# Altium schematic sheet DC Battery tester.SchDoc
size 594 x 420 mm; SheetNumber: 1; SheetTotal: 1
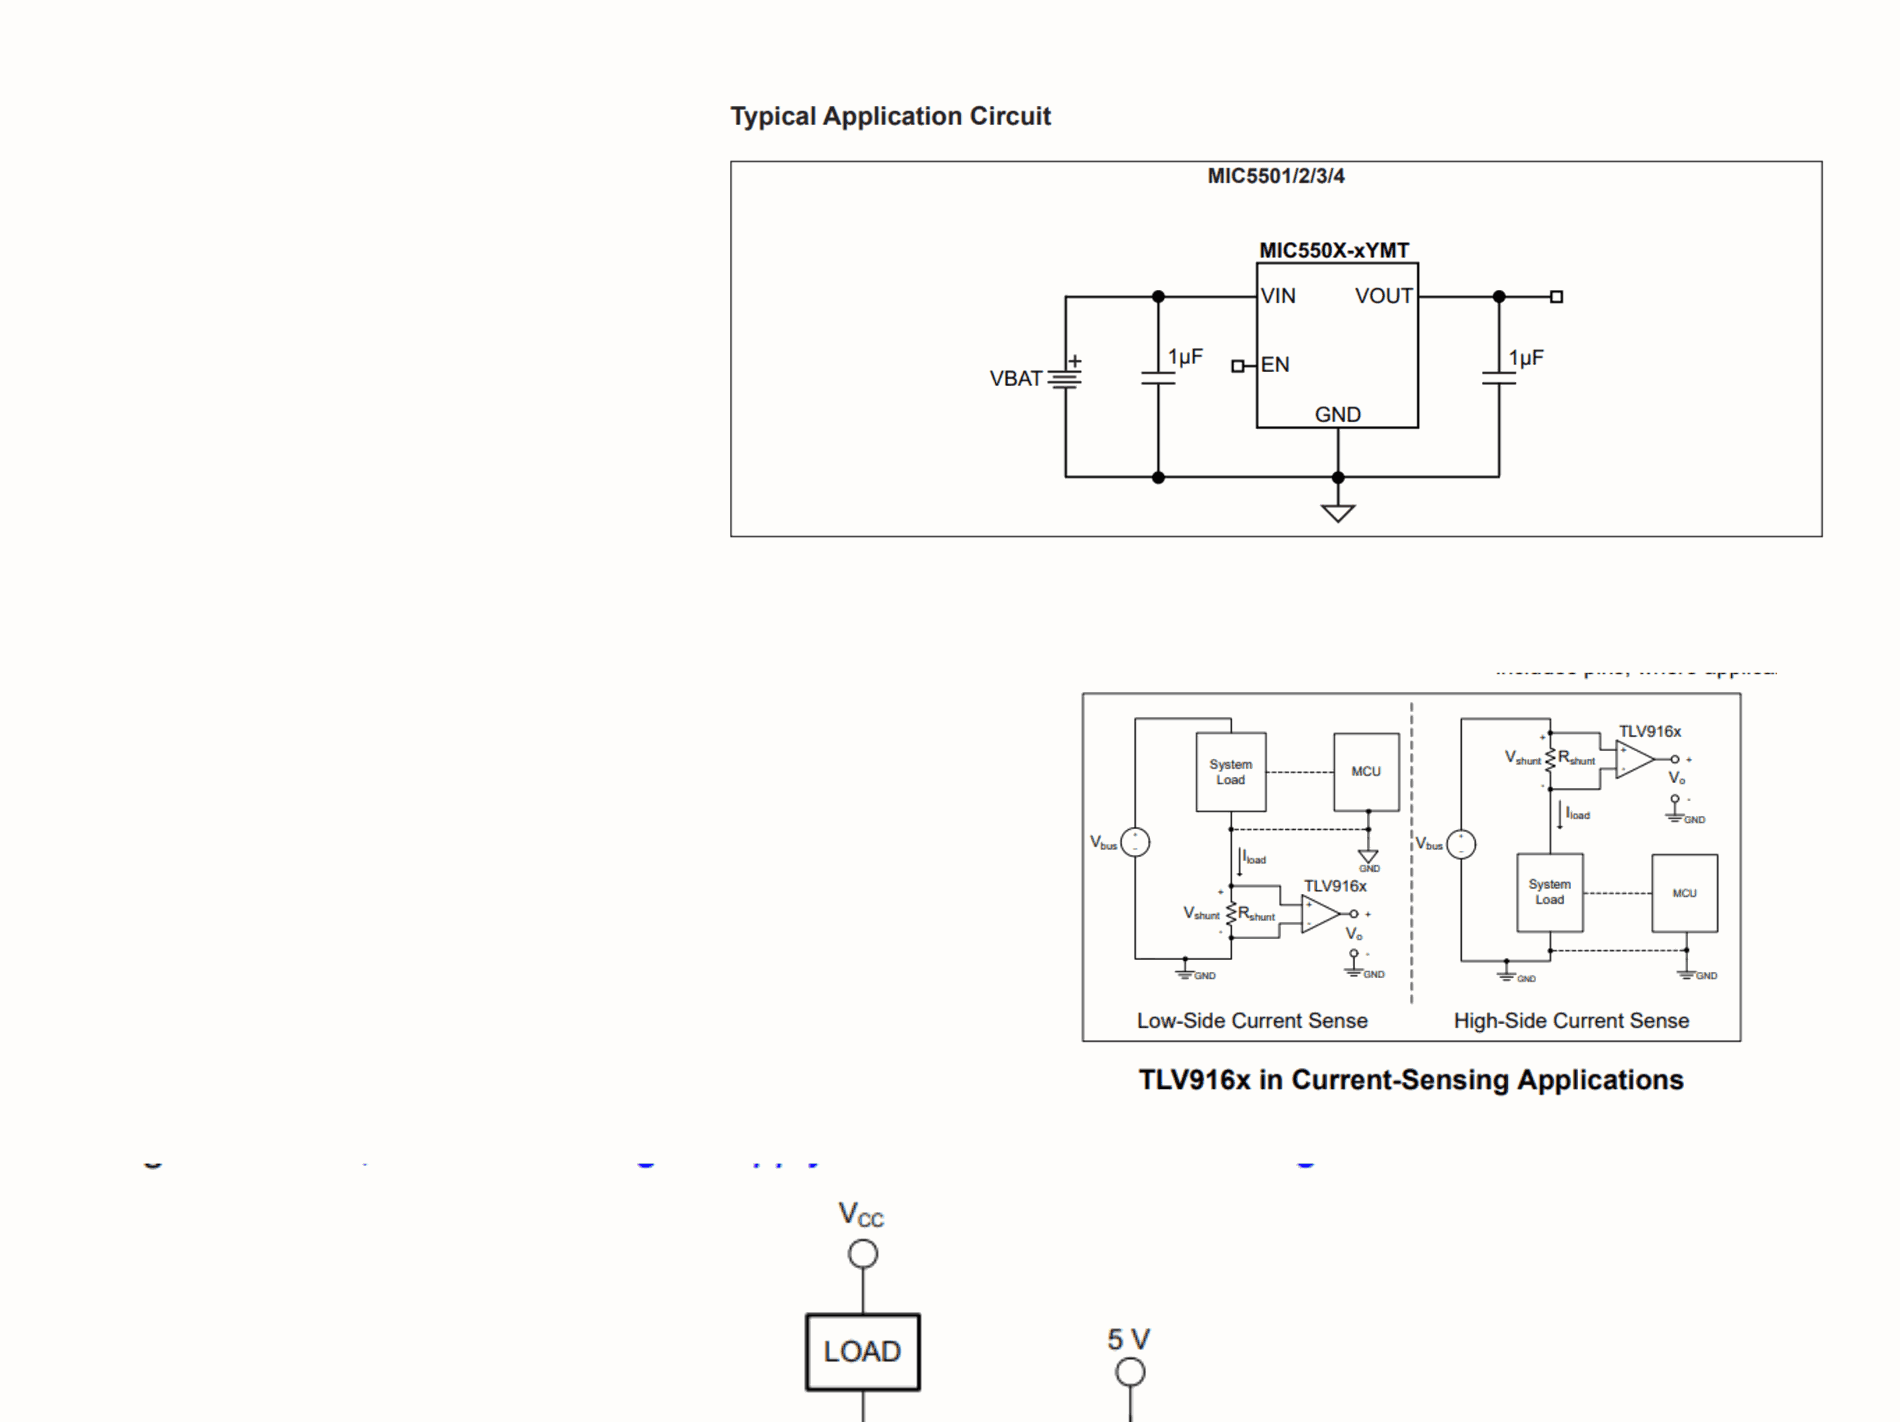
[diagram p0: DC Battery tester.SchDoc, top column 1 of 4]
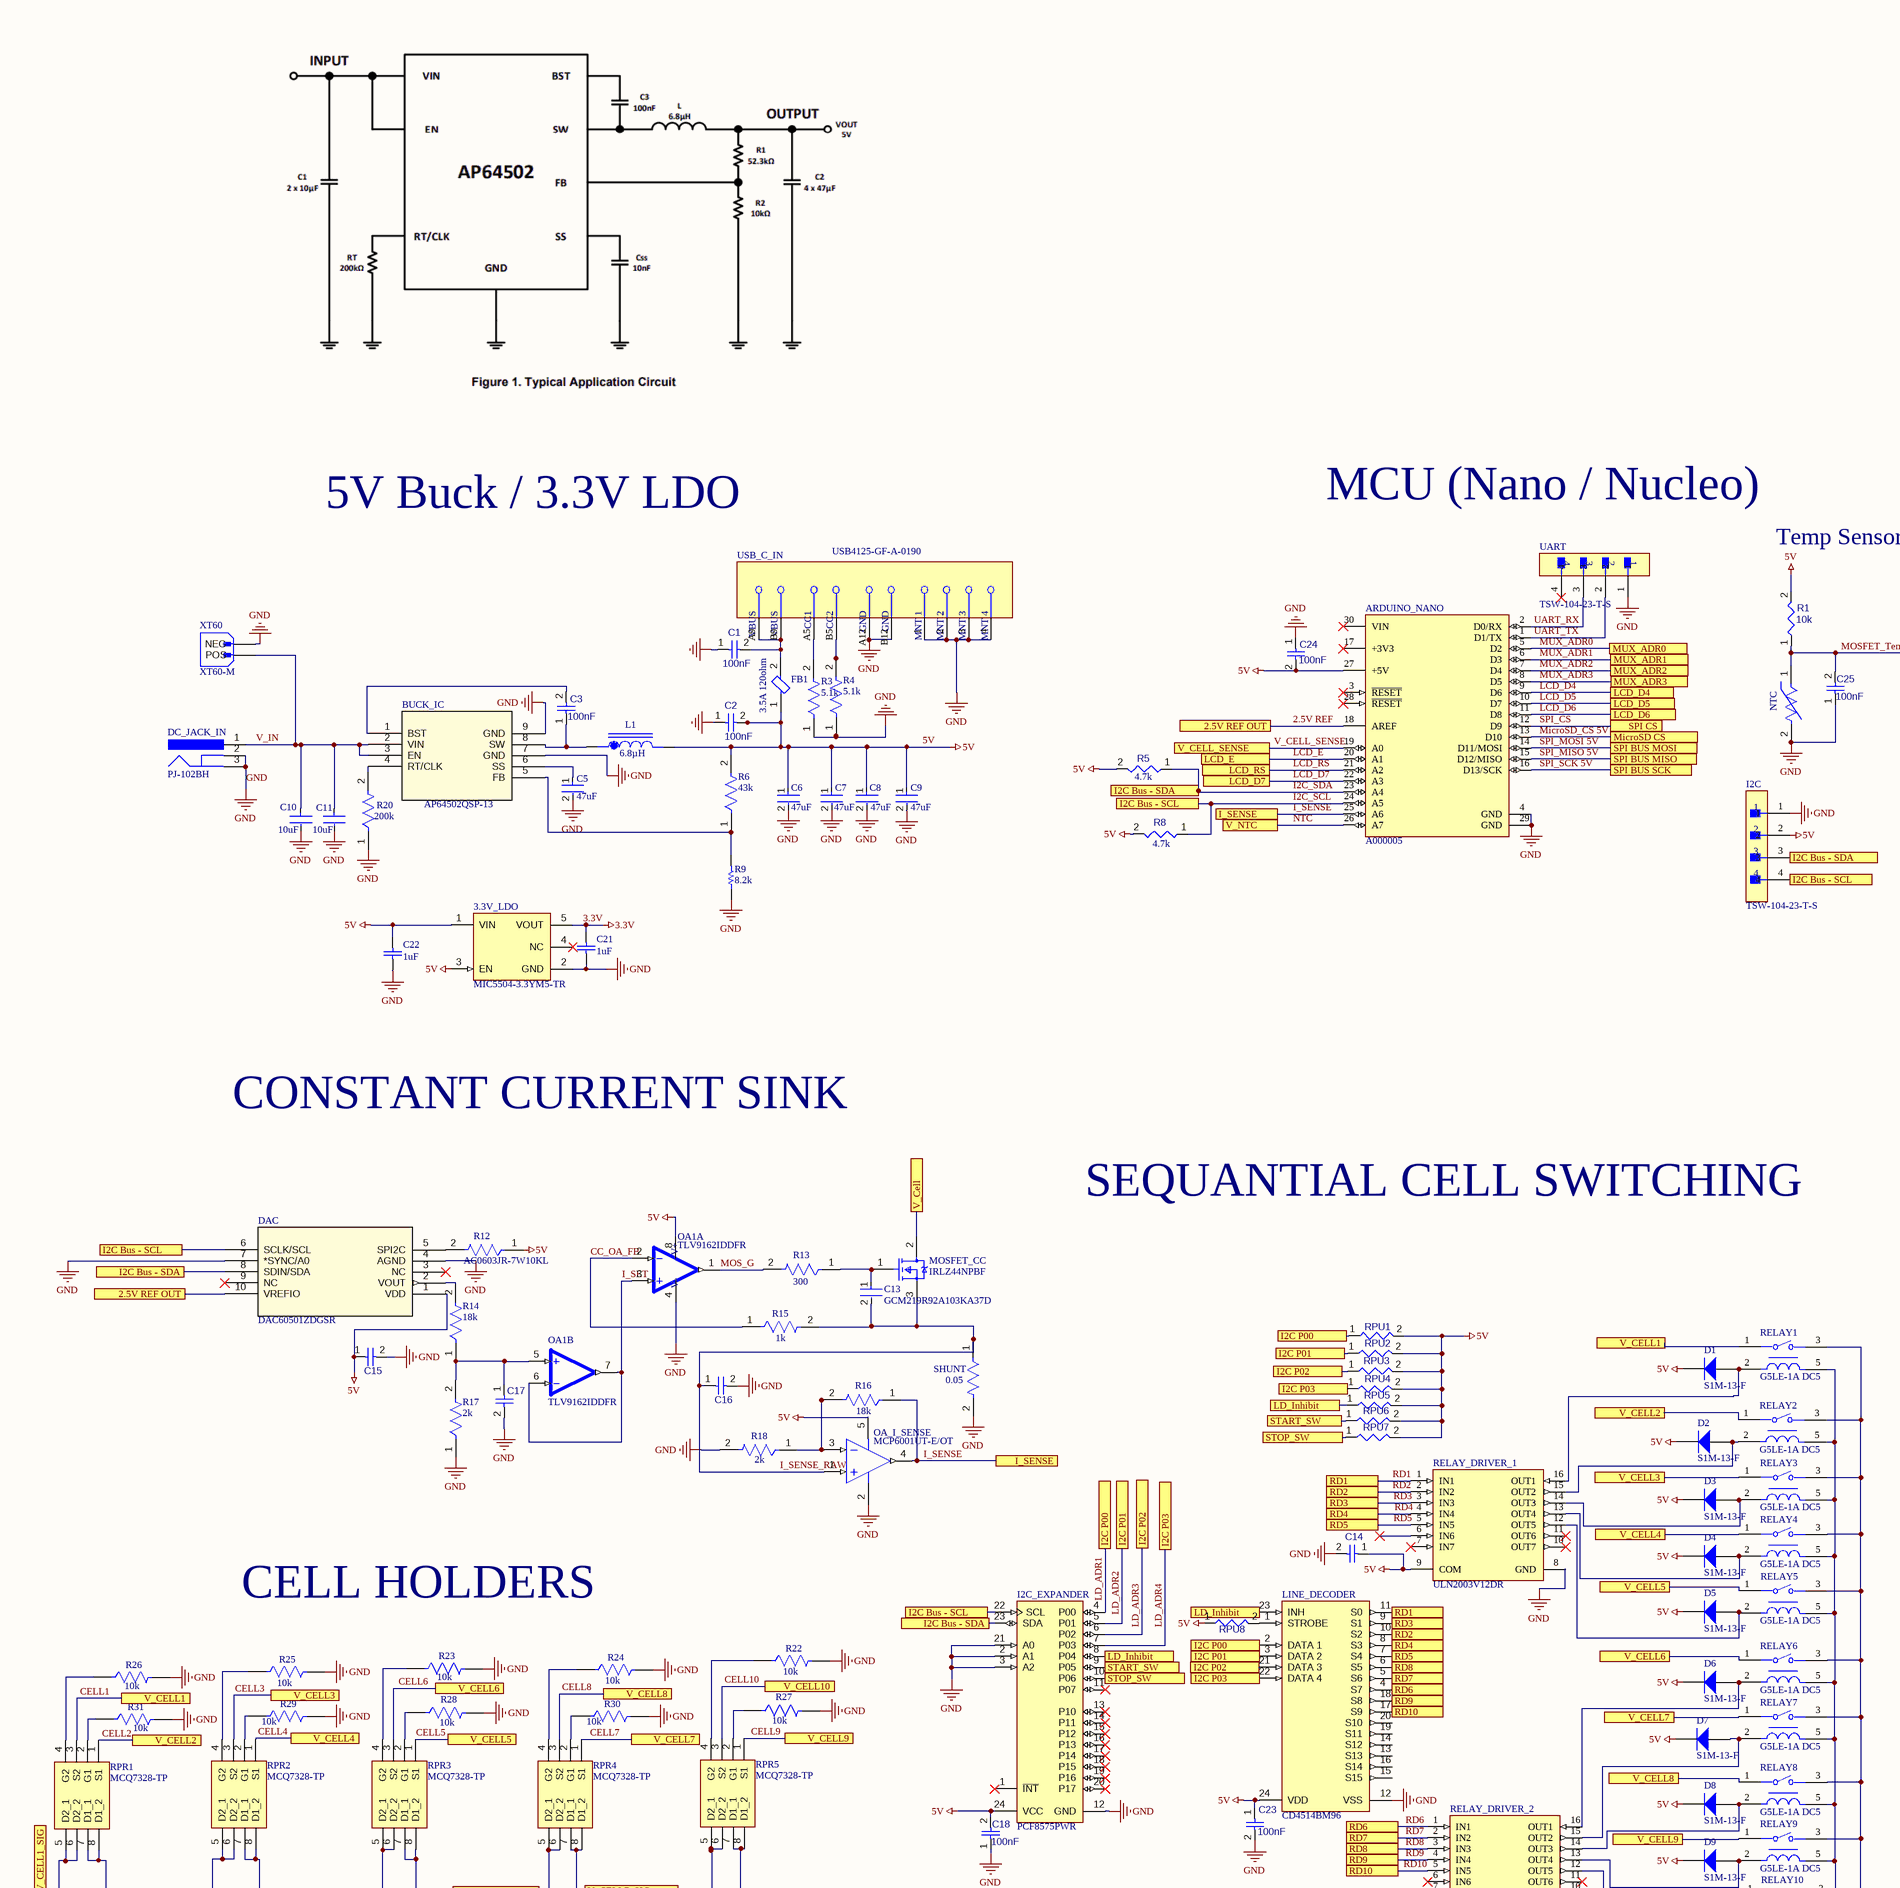
[diagram p1: DC Battery tester.SchDoc, top column 2 of 4]
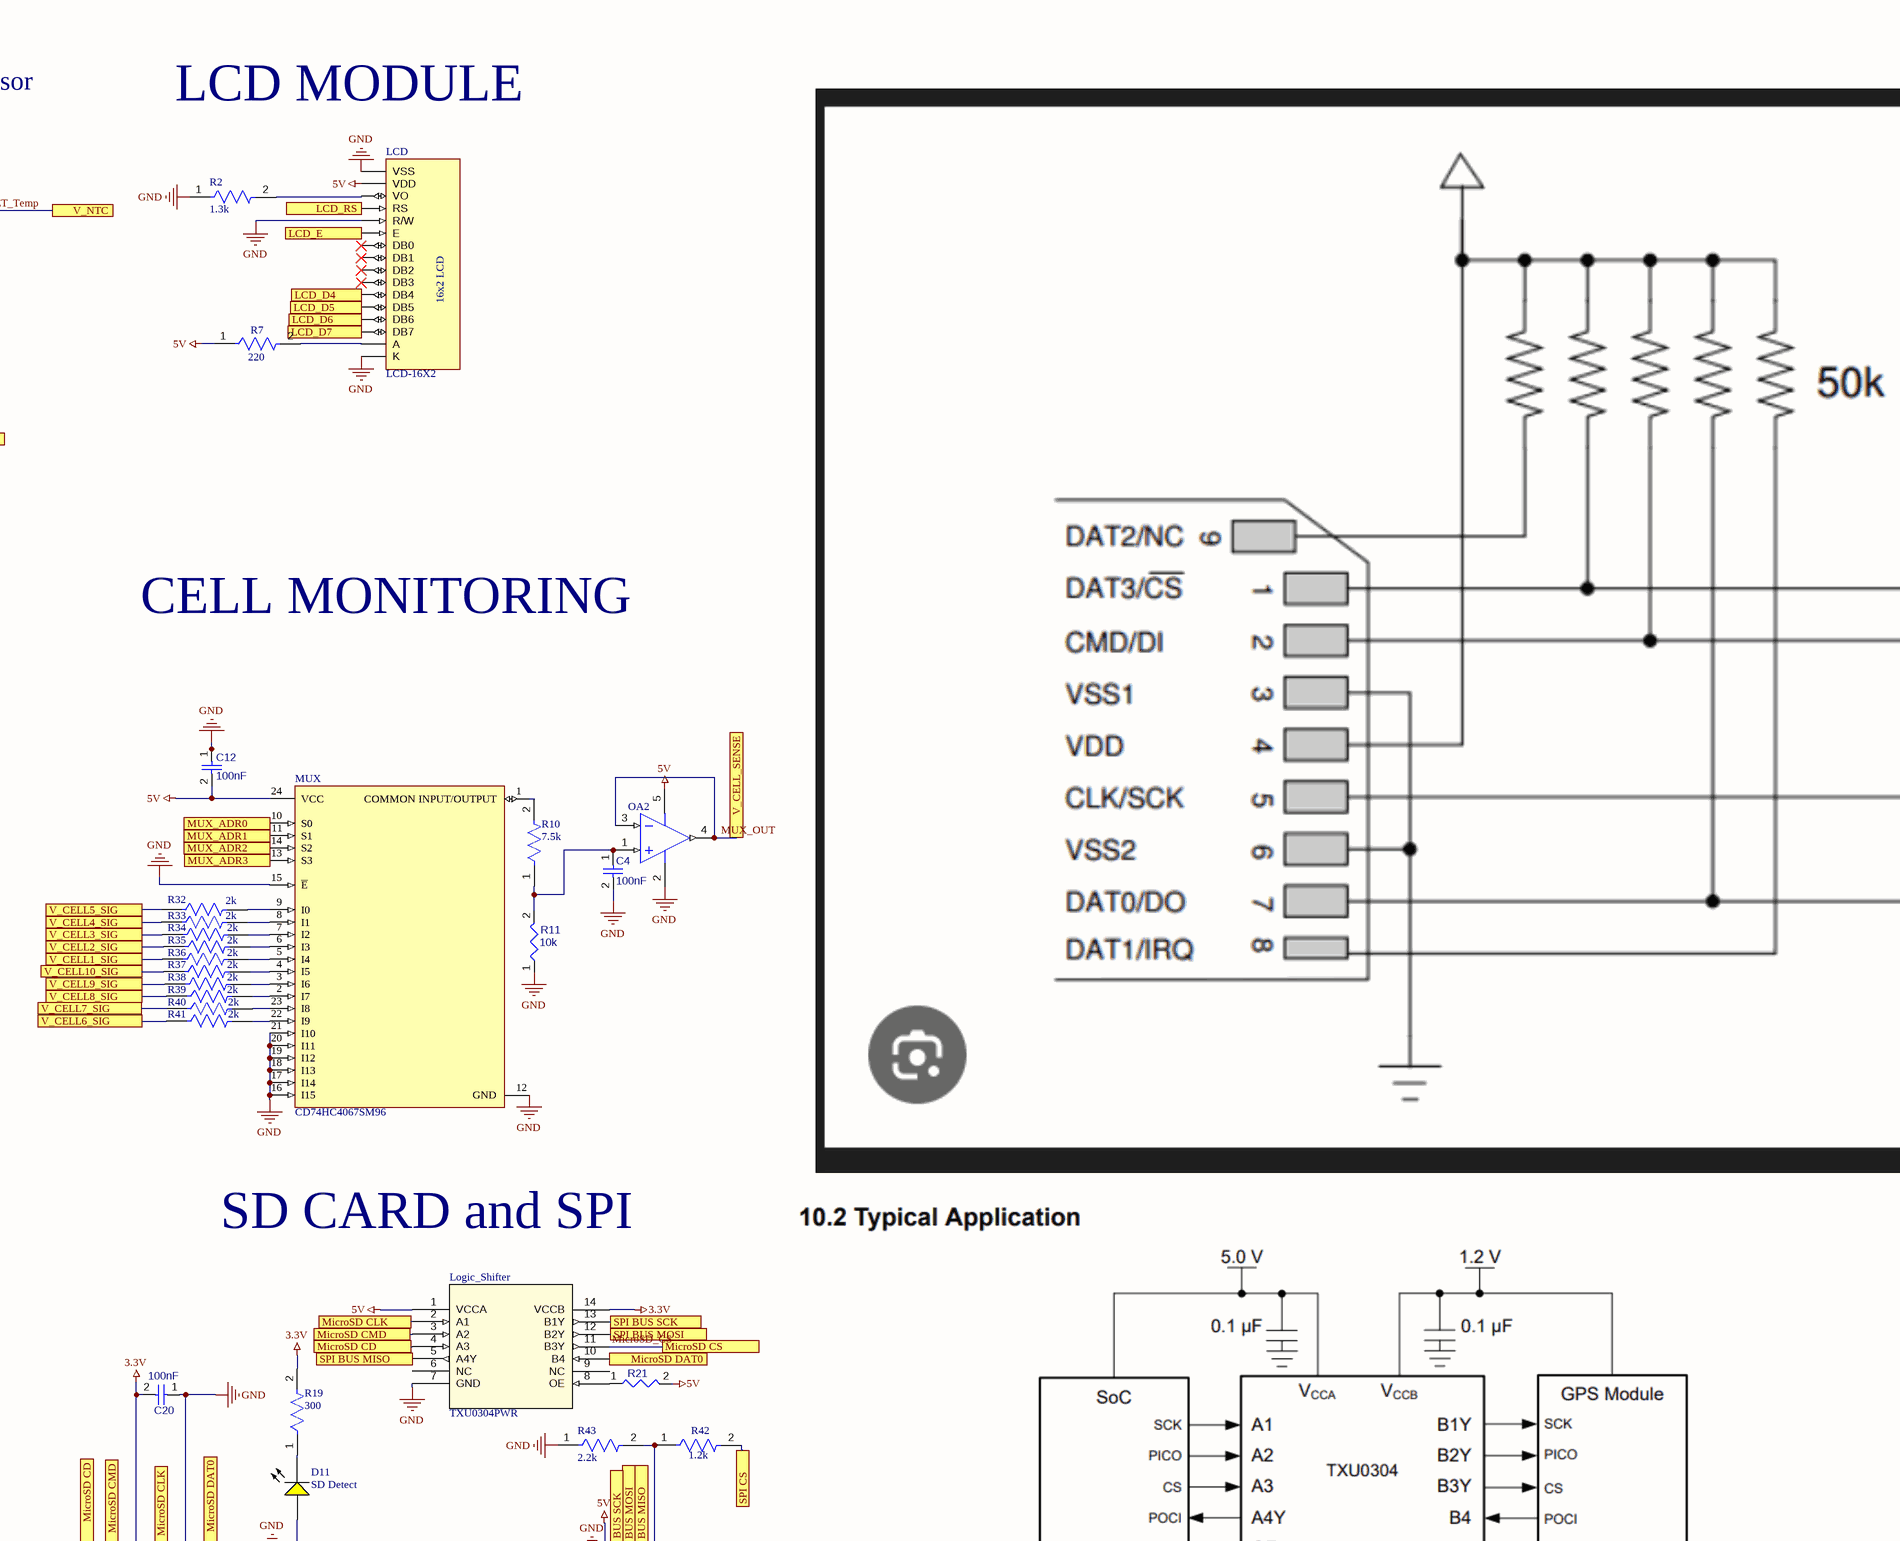
[diagram p2: DC Battery tester.SchDoc, top column 3 of 4]
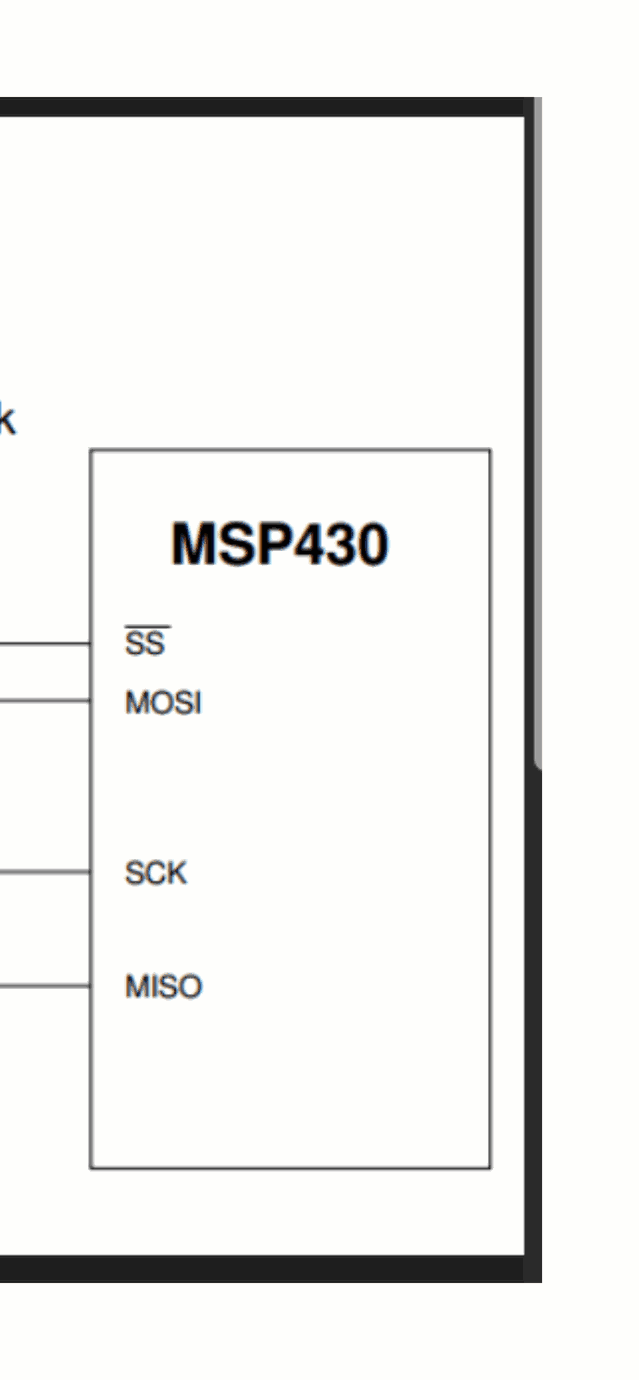
[diagram p3: DC Battery tester.SchDoc, top column 4 of 4]
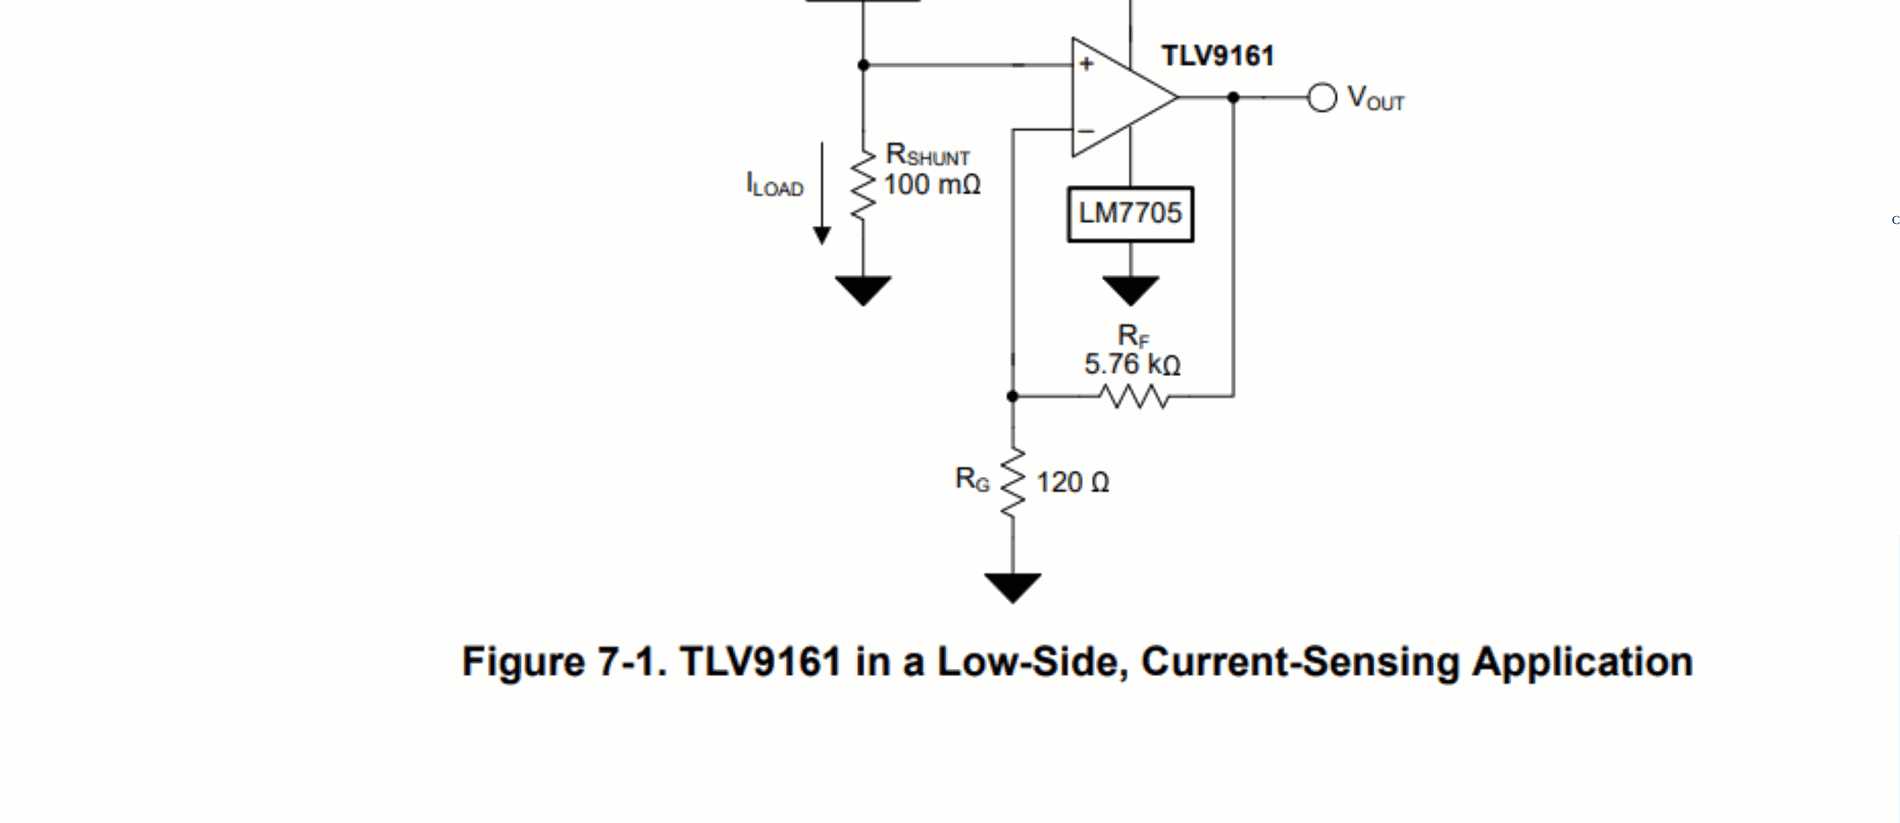
[diagram p4: DC Battery tester.SchDoc, centre column 1 of 4]
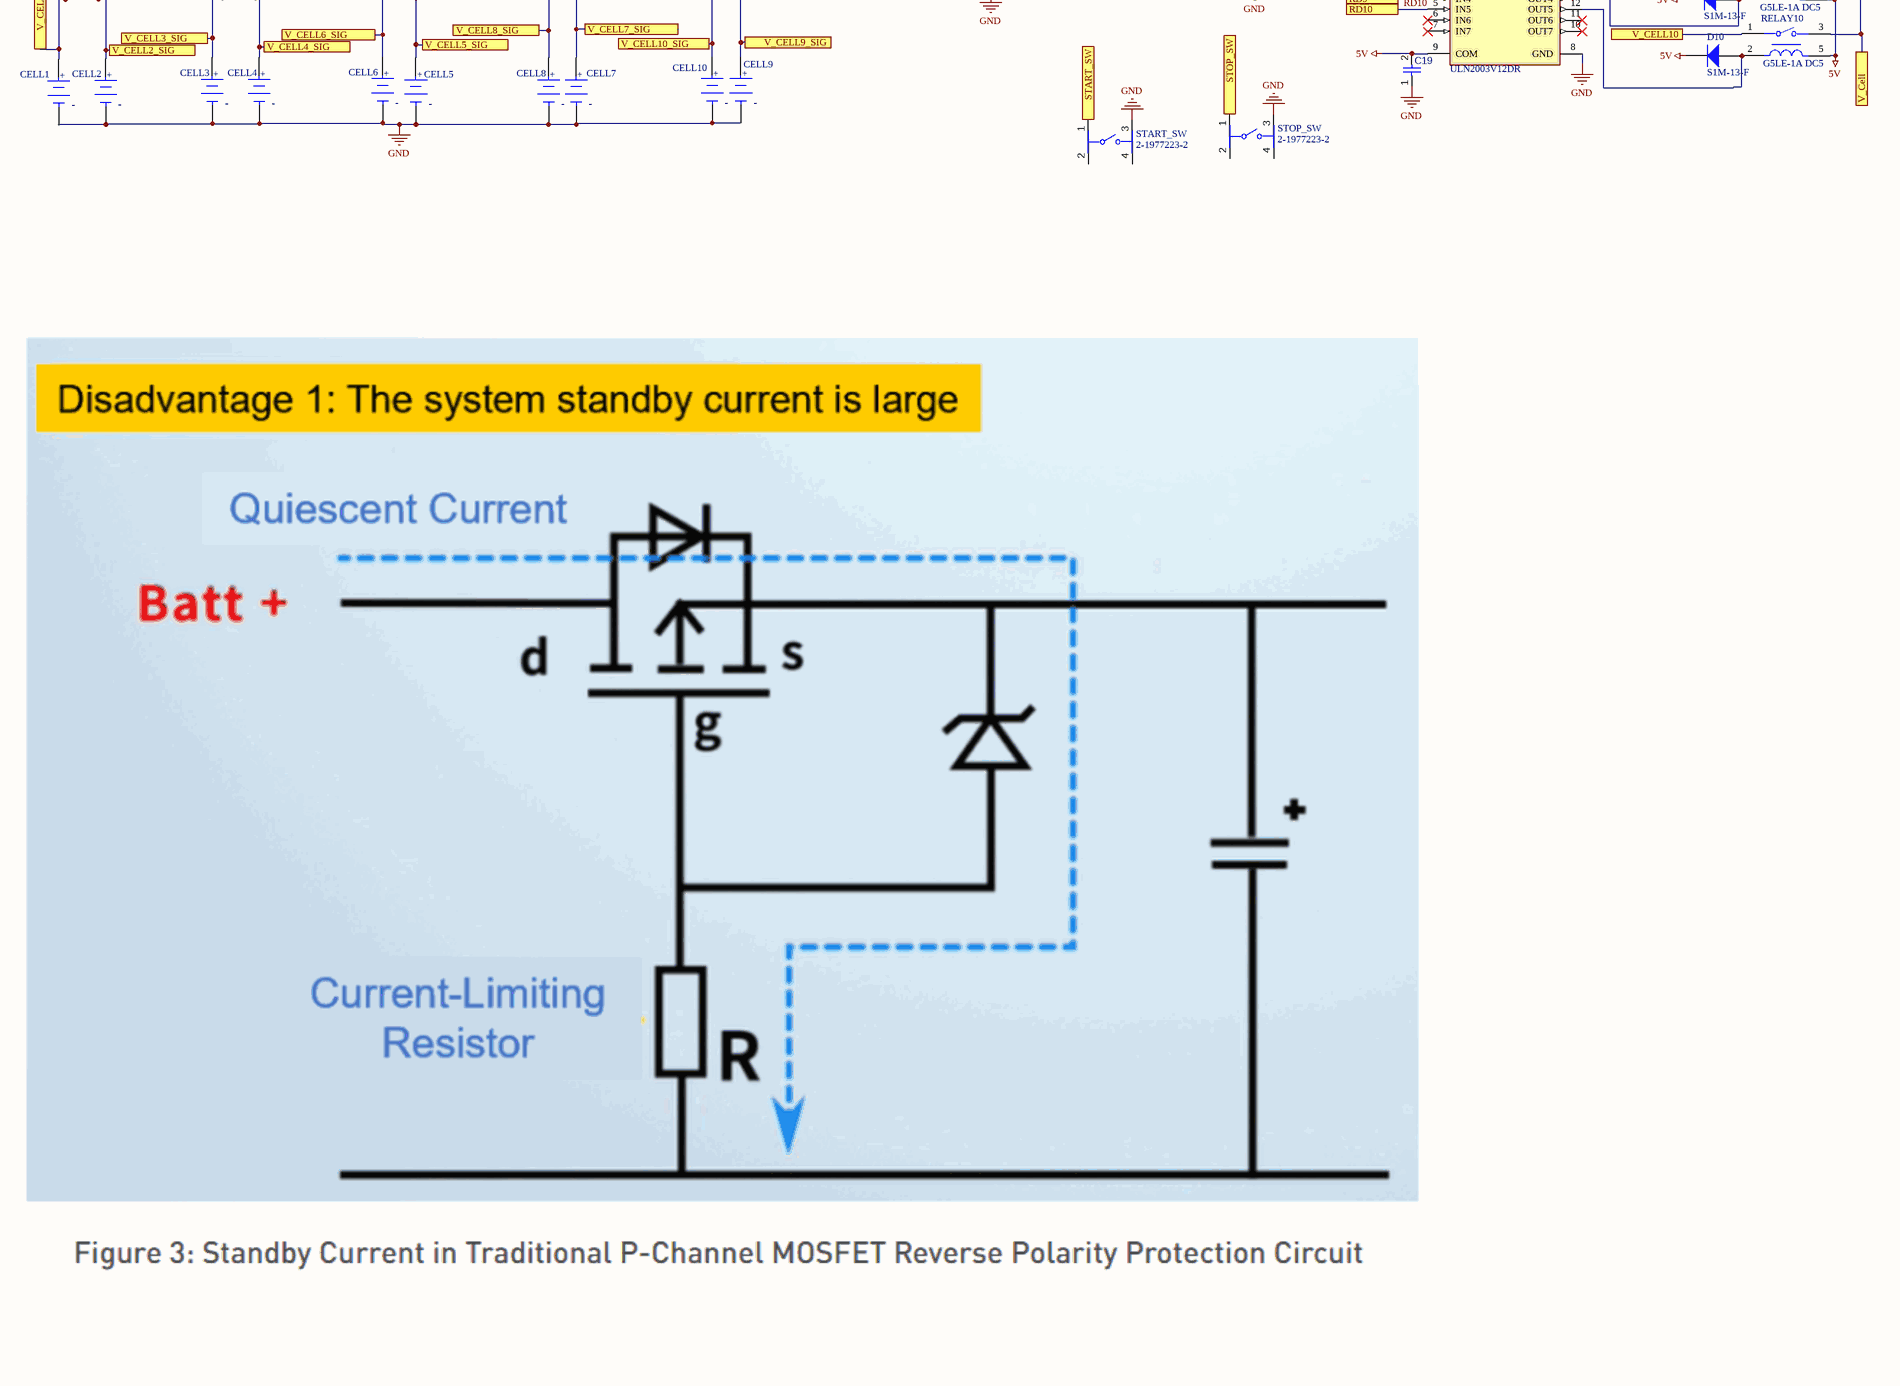
[diagram p5: DC Battery tester.SchDoc, centre column 2 of 4]
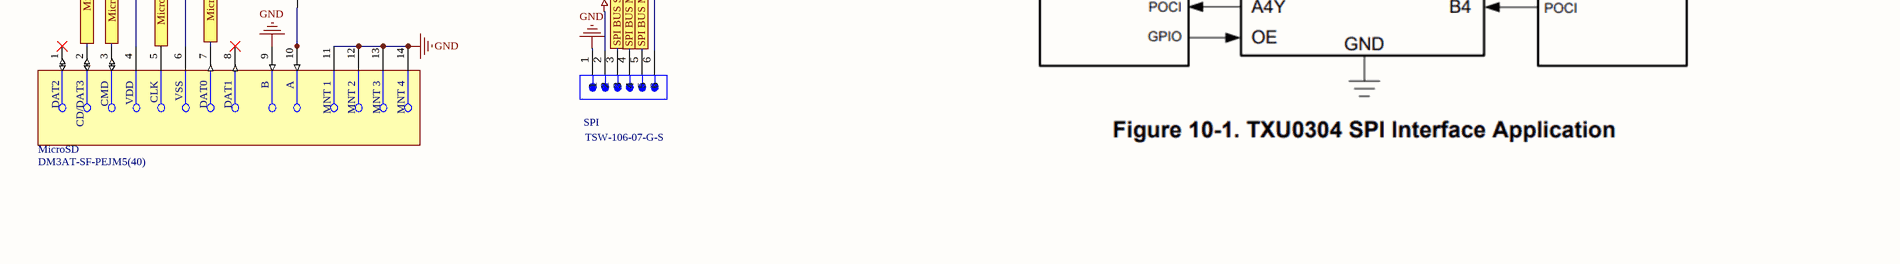
[diagram p6: DC Battery tester.SchDoc, centre column 3 of 4]

## Parts
3.3V_LDO  MIC5504-3.3YM5-TR  [FP-SOT23-5LD-PL-1-MFG]
ARDUINO_NANO  A000005  [FP-A000005-MFG]
BUCK_IC  AP64502QSP-13  [SO-8EP_DIO]
C1  100nF  [CAPC2013X95X50LL10T25]
C2  100nF  [CAPC2013X95X50LL10T25]
C3  100nF  [CAPC2013X95X50LL10T25]
C4  100nF  [CAPC2013X95X50LL10T25]
C5  47uF  [FP-GRM31C-0_2-e0_3_0_8-IPC_C]
C6  47uF  [FP-GRM31C-0_2-e0_3_0_8-IPC_C]
C7  47uF  [FP-GRM31C-0_2-e0_3_0_8-IPC_C]
C8  47uF  [FP-GRM31C-0_2-e0_3_0_8-IPC_C]
C9  47uF  [FP-GRM31C-0_2-e0_3_0_8-IPC_C]
C10  10uF  [FP-CL31-IPC_C]
C11  10uF  [FP-CL31-IPC_C]
C12  100nF  [CAPC2013X95X50LL10T25]
C13  GCM219R92A103KA37D  [FP-GCM219-0_15-IPC_C]
C14  100nF  [CAPC2013X95X50LL10T25]  (value not drawn)
C15  100nF  [CAPC2013X95X50LL10T25]  (value not drawn)
C16  100nF  [CAPC2013X95X50LL10T25]  (value not drawn)
C17  100nF  [CAPC2013X95X50LL10T25]  (value not drawn)
C18  100nF  [CAPC2013X95X50LL10T25]
C19  100nF  [CAPC2013X95X50LL10T25]  (value not drawn)
C20  100nF  [CAPC2013X95X50LL10T25]
C21  1uF  [CAPC3216X180X50ML20T25]
C22  1uF  [CAPC3216X180X50ML20T25]
C23  100nF  [CAPC2013X95X50LL10T25]
C24  100nF  [CAPC2013X95X50LL10T25]
C25  100nF  [CAPC2013X95X50LL10T25]
CELL1  1042P  [FP-1042P-MFG]  (value not drawn)
CELL2  1042P  [FP-1042P-MFG]  (value not drawn)
CELL3  1042P  [FP-1042P-MFG]  (value not drawn)
CELL4  1042P  [FP-1042P-MFG]  (value not drawn)
CELL5  1042P  [FP-1042P-MFG]  (value not drawn)
CELL6  1042P  [FP-1042P-MFG]  (value not drawn)
CELL7  1042P  [FP-1042P-MFG]  (value not drawn)
CELL8  1042P  [FP-1042P-MFG]  (value not drawn)
CELL9  1042P  [FP-1042P-MFG]  (value not drawn)
CELL10  1042P  [FP-1042P-MFG]  (value not drawn)
D1  S1M-13-F  [DIOD-S1M-13-F-SMA-2_V]
D2  S1M-13-F  [DIOD-S1M-13-F-SMA-2_V]
D3  S1M-13-F  [DIOD-S1M-13-F-SMA-2_V]
D4  S1M-13-F  [DIOD-S1M-13-F-SMA-2_V]
D5  S1M-13-F  [DIOD-S1M-13-F-SMA-2_V]
D6  S1M-13-F  [DIOD-S1M-13-F-SMA-2_V]
D7  S1M-13-F  [DIOD-S1M-13-F-SMA-2_V]
D8  S1M-13-F  [DIOD-S1M-13-F-SMA-2_V]
D9  S1M-13-F  [DIOD-S1M-13-F-SMA-2_V]
D10  S1M-13-F  [DIOD-S1M-13-F-SMA-2_V]
D11  SD Detect  [LTST-C170KSKT_V]
DAC  DAC60501ZDGSR  [DGS10_TEX]
DC_JACK_IN  PJ-102BH  [CUI-PJ-102BH_V]
FB1  3.5A 120ohm  [FP-BLM31-0_2-t1_1-MFG]
I2C  TSW-104-23-T-S  [FP-TSW-104-23-T-S-MFG]
I2C_EXPANDER  PCF8575PWR  [PW0024A_L]
L1  value 6.8µH  [IND_MGAH06036R8M-10]  (hidden comment: MGAH06036R8M-10)
LCD  LCD-16X2  [MODULE_LCD-16X2]
LINE_DECODER  CD4514BM96  [DW0024A_N]
Logic_Shifter  TXU0304PWR  [TSSOP14_PW_TEX]
MicroSD  DM3AT-SF-PEJM5(40)  [FP-DM3AT-SF-PEJM5_40-MFG]
MOSFET_CC  IRLZ44NPBF  [FP-PG-TO220-3-MFG]
MUX  CD74HC4067SM96  [FP-DB0024A-IPC_C]
NTC  NXRT15XH103FA1B030  [FP-NXR_151B030-MFG]  (value not drawn)
OA1  TLV9162IDDFR  [SOT65P280X110-8N]  (parts A,B of 2)
OA2  MCP6001UT-E/OT  [SOT-23-OT5_L]  (value not drawn)
OA_I_SENSE  MCP6001UT-E/OT  [SOT-23-OT5_L]
R1  10k  [RESC2013X50X35ML15T15]
R2  1.3k  [FP-RMCF0805-IPC_B]
R3  5.1k  [FP-MCT0603-IPC_B]
R4  5.1k  [FP-MCT0603-IPC_B]
R5  value 4.7k  [RESC2013X70X40ML20T20]  (hidden comment: Resistor 4k7 +/-1% 0805 125 mW)
R6  43k  [FP-MCU0805-IPC_C]
R7  220  [FP-RMCF0805-IPC_A]
R8  value 4.7k  [RESC2013X70X40ML20T20]  (hidden comment: Resistor 4k7 +/-1% 0805 125 mW)
R9  8.2k  [RESC0805(2012)_N]
R10  7.5k  [FP-CRCW0805-HPe3-IPC_B]
R11  10k  [RESC2013X50X35ML15T15]
R12  AC0603JR-7W10KL  [FP-AC0603-IPC_A]
R13  300  [FP-CR0805-MFG]
R14  18k  [FP-CRGP0805-IPC_C]
R15  1k  [FP-RN73R2A-IPC_A]
R16  18k  [FP-CRGP0805-IPC_C]
R17  2k  [FP-MCU0805-IPC_A]
R18  2k  [FP-MCU0805-IPC_A]
R19  300  [FP-CR0805-MFG]
R20  200k  [FP-CRCW0603-HPe3-MFG]
R21  Resistor 4k7 +/-1% 0805 125 mW  [RESC2013X70X40ML20T20]  (value not drawn)
R22  10k  [FP-AC0603-IPC_A]
R23  10k  [FP-AC0603-IPC_A]
R24  10k  [FP-AC0603-IPC_A]
R25  10k  [FP-AC0603-IPC_A]
R26  10k  [FP-AC0603-IPC_A]
R27  10k  [FP-AC0603-IPC_A]
R28  10k  [FP-AC0603-IPC_A]
R29  10k  [FP-AC0603-IPC_A]
R30  10k  [FP-AC0603-IPC_A]
R31  10k  [FP-AC0603-IPC_A]
R32  2k  [FP-TFCR0603-IPC_B]
R33  2k  [FP-TFCR0603-IPC_B]
R34  2k  [FP-TFCR0603-IPC_B]
R35  2k  [FP-TFCR0603-IPC_B]
R36  2k  [FP-TFCR0603-IPC_B]
R37  2k  [FP-TFCR0603-IPC_B]
R38  2k  [FP-TFCR0603-IPC_B]
R39  2k  [FP-TFCR0603-IPC_B]
R40  2k  [FP-TFCR0603-IPC_B]
R41  2k  [FP-TFCR0603-IPC_B]
R42  1.2k  [FP-CRGCQ0603-IPC_C]
R43  2.2k  [FP-CRGCQ0603-IPC_C]
RELAY1  G5LE-1A DC5  [FP-G5LE-1A_DC5-MFG]
RELAY2  G5LE-1A DC5  [FP-G5LE-1A_DC5-MFG]
RELAY3  G5LE-1A DC5  [FP-G5LE-1A_DC5-MFG]
RELAY4  G5LE-1A DC5  [FP-G5LE-1A_DC5-MFG]
RELAY5  G5LE-1A DC5  [FP-G5LE-1A_DC5-MFG]
RELAY6  G5LE-1A DC5  [FP-G5LE-1A_DC5-MFG]
RELAY7  G5LE-1A DC5  [FP-G5LE-1A_DC5-MFG]
RELAY8  G5LE-1A DC5  [FP-G5LE-1A_DC5-MFG]
RELAY9  G5LE-1A DC5  [FP-G5LE-1A_DC5-MFG]
RELAY10  G5LE-1A DC5  [FP-G5LE-1A_DC5-MFG]
RELAY_DRIVER_1  ULN2003V12DR  [FP-D0016A-MFG]
RELAY_DRIVER_2  ULN2003V12DR  [FP-D0016A-MFG]
RPR1  MCQ7328-TP  [SOIC127P600X175-8N]
RPR2  MCQ7328-TP  [SOIC127P600X175-8N]
RPR3  MCQ7328-TP  [SOIC127P600X175-8N]
RPR4  MCQ7328-TP  [SOIC127P600X175-8N]
RPR5  MCQ7328-TP  [SOIC127P600X175-8N]
RPU1  Resistor 4k7 +/-1% 0805 125 mW  [RESC2013X70X40ML20T20]  (value not drawn)
RPU2  Resistor 4k7 +/-1% 0805 125 mW  [RESC2013X70X40ML20T20]  (value not drawn)
RPU3  Resistor 4k7 +/-1% 0805 125 mW  [RESC2013X70X40ML20T20]  (value not drawn)
RPU4  Resistor 4k7 +/-1% 0805 125 mW  [RESC2013X70X40ML20T20]  (value not drawn)
RPU5  Resistor 4k7 +/-1% 0805 125 mW  [RESC2013X70X40ML20T20]  (value not drawn)
RPU6  Resistor 4k7 +/-1% 0805 125 mW  [RESC2013X70X40ML20T20]  (value not drawn)
RPU7  Resistor 4k7 +/-1% 0805 125 mW  [RESC2013X70X40ML20T20]  (value not drawn)
RPU8  Resistor 4k7 +/-1% 0805 125 mW  [RESC2013X70X40ML20T20]  (value not drawn)
SHUNT  0.05  [FP-CRA2512-IPC_A]
SPI  TSW-106-07-G-S  [SMTC-TSW-106-07-X-S]
START_SW  2-1977223-2  [FP-2-1977223-2-MFG]
STOP_SW  2-1977223-2  [FP-2-1977223-2-MFG]
UART  TSW-104-23-T-S  [FP-TSW-104-23-T-S-MFG]
USB_C_IN  USB4125-GF-A-0190  [FP-USB4125-GF-A-0190-MFG]
XT60  XT60-M  [AMASS_XT60-M]

## Ports
2.5V REF OUT, I2C Bus - SCL, I2C Bus - SDA, I2C P00, I2C P01, I2C P02, I2C P03, I_SENSE, LCD_D4, LCD_D5, LCD_D6, LCD_D7, LCD_E, LCD_RS, LD_Inhibit, MicroSD CD, MicroSD CLK, MicroSD CMD, MicroSD CS, MicroSD DAT0, MUX_ADR0, MUX_ADR1, MUX_ADR2, MUX_ADR3, RD1, RD2, RD3, RD4, RD5, RD6, RD7, RD8, RD9, RD10, SPI BUS MISO, SPI BUS MOSI, SPI BUS SCK, SPI CS, START_SW, STOP_SW, V_Cell, V_CELL1, V_CELL1_SIG, V_CELL2, V_CELL2_SIG, V_CELL3, V_CELL3_SIG, V_CELL4, V_CELL4_SIG, V_CELL5, V_CELL5_SIG, V_CELL6, V_CELL6_SIG, V_CELL7, V_CELL7_SIG, V_CELL8, V_CELL8_SIG, V_CELL9, V_CELL9_SIG, V_CELL10, V_CELL10_SIG, V_CELL_SENSE, V_NTC

## Nets
3.3V: 3.3V_LDO.5(VOUT) C20.2 C21.2 Logic_Shifter.14(VCCB) MicroSD.4(VDD) R19.2
5V: 3.3V_LDO.1(VIN) 3.3V_LDO.3(EN) ARDUINO_NANO.27(+5V) C2.2 C6.1 C7.1 C8.1 C9.1 C12.2 C14.1 C15.1 C18.2 C19.2 C22.2 C23.1 C24.2 D1.2(K) D2.2(K) D3.2(K) D4.2(K) D5.2(K) D6.2(K) D7.2(K) D8.2(K) D9.2(K) D10.2(K) DAC.1(VDD) FB1.1 I2C.2 I2C_EXPANDER.24(VCC) L1.2 LCD.2(VDD) LINE_DECODER.24(VDD) Logic_Shifter.1(VCCA) MUX.24(VCC) OA1.8(V+) OA2.5(VDD) OA_I_SENSE.5(VDD) R1.2 R5.2 R6.2 R7.1 R8.2 R12.1 R21.2 RELAY1.5 RELAY2.5 RELAY3.5 RELAY4.5 RELAY5.5 RELAY6.5 RELAY7.5 RELAY8.5 RELAY9.5 RELAY10.5 RELAY_DRIVER_1.9(COM) RELAY_DRIVER_2.9(COM) RPU1.2 RPU2.2 RPU3.2 RPU4.2 RPU5.2 RPU6.2 RPU7.2 RPU8.1 SPI.2
GND: 3.3V_LDO.2(GND) ARDUINO_NANO.4(GND) ARDUINO_NANO.29(GND) BUCK_IC.7(GND) BUCK_IC.9(GND) C1.1 C2.1 C4.2 C5.2 C6.2 C7.2 C8.2 C9.2 C10.2 C11.2 C12.1 C14.2 C15.2 C16.2 C17.2 C18.1 C19.1 C20.1 C21.1 C22.1 C23.2 C24.1 C25.1 CELL1.1(C) CELL2.1(C) CELL3.1(C) CELL4.1(C) CELL5.1(C) CELL6.1(C) CELL7.1(C) CELL8.1(C) CELL9.1(C) CELL10.1(C) DAC.4(AGND) DAC.7(*SYNC/A0) DC_JACK_IN.2 DC_JACK_IN.3 I2C.1 I2C_EXPANDER.2(A1) I2C_EXPANDER.3(A2) I2C_EXPANDER.12(GND) I2C_EXPANDER.21(A0) LCD.1(VSS) LCD.5(R/W) LCD.16(K) LINE_DECODER.12(VSS) Logic_Shifter.7(GND) MicroSD.6(VSS) MicroSD.9(B) MicroSD.11(MNT_1) MicroSD.12(MNT_2) MicroSD.13(MNT_3) MicroSD.14(MNT_4) MUX.12(GND) MUX.15(~{E}) MUX.16(I15) MUX.17(I14) MUX.18(I13) MUX.19(I12) MUX.20(I11) MUX.21(I10) NTC.2 OA1.4(V-) OA2.2(VSS) OA_I_SENSE.2(VSS) R2.1 R3.1 R4.1 R9.1 R11.1 R17.1 R18.2 R20.1 R22.2 R23.2 R24.2 R25.2 R26.2 R27.2 R28.2 R29.2 R30.2 R31.2 R43.1 RELAY_DRIVER_1.8(GND) RELAY_DRIVER_2.8(GND) SHUNT.2 SPI.1 START_SW.3 STOP_SW.3 UART.1 USB_C_IN.1(MNT_1) USB_C_IN.2(MNT_2) USB_C_IN.3(MNT_3) USB_C_IN.4(MNT_4) USB_C_IN.A12(GND) USB_C_IN.B12(GND) XT60.N(NEG)
2.5V REF: ARDUINO_NANO.18(AREF) DAC.10(VREFIO) ; port 2.5V REF OUT
CC_OA_FB: OA1.2(IN1-) R15.1
CELL1: RELAY1.1 RPR1.3(S2) ; port V_CELL1
CELL2: RELAY2.1 RPR1.1(S1) ; port V_CELL2
CELL3: RELAY3.1 RPR2.3(S2) ; port V_CELL3
CELL4: RELAY4.1 RPR2.1(S1) ; port V_CELL4
CELL5: RELAY5.1 RPR3.1(S1) ; port V_CELL5
CELL6: RELAY6.1 RPR3.3(S2) ; port V_CELL6
CELL7: RELAY7.1 RPR4.1(S1) ; port V_CELL7
CELL8: RELAY8.1 RPR4.3(S2) ; port V_CELL8
CELL9: RELAY9.1 RPR5.1(S1) ; port V_CELL9
CELL10: RELAY10.1 RPR5.3(S2) ; port V_CELL10
I2C_SCL: ARDUINO_NANO.24(A5) DAC.6(SCLK/SCL) I2C.4 I2C_EXPANDER.22(SCL) R8.1 ; port I2C Bus - SCL
I2C_SDA: ARDUINO_NANO.23(A4) DAC.8(SDIN/SDA) I2C.3 I2C_EXPANDER.23(SDA) R5.1 ; port I2C Bus - SDA
I_SENSE: ARDUINO_NANO.25(A6) OA_I_SENSE.4(VOUT) R16.1 ; port I_SENSE
I_SENSE_RAW: C13.2 C16.1 MOSFET_CC.3(S) OA_I_SENSE.1(VIN+) R15.2 SHUNT.1
I_SET: OA1.3(IN1+) OA1.6(IN2-) OA1.7(OUT2)
LCD_D4: ARDUINO_NANO.9(D6) LCD.11(DB4) ; port LCD_D4
LCD_D5: ARDUINO_NANO.10(D7) LCD.12(DB5) ; port LCD_D5
LCD_D6: ARDUINO_NANO.11(D8) LCD.13(DB6) ; port LCD_D6
LCD_D7: ARDUINO_NANO.22(A3) LCD.14(DB7) ; port LCD_D7
LCD_E: ARDUINO_NANO.20(A1) LCD.6(E) ; port LCD_E
LCD_RS: ARDUINO_NANO.21(A2) LCD.4(RS) ; port LCD_RS
LD_ADR1: I2C_EXPANDER.4(P00) LINE_DECODER.2(DATA_1) RPU1.1 ; port I2C P00
LD_ADR2: I2C_EXPANDER.5(P01) LINE_DECODER.3(DATA_2) RPU2.1 ; port I2C P01
LD_ADR3: I2C_EXPANDER.6(P02) LINE_DECODER.21(DATA_3) RPU3.1 ; port I2C P02
LD_ADR4: I2C_EXPANDER.7(P03) LINE_DECODER.22(DATA_4) RPU4.1 ; port I2C P03
LD_Inhibit: I2C_EXPANDER.8(P04) LINE_DECODER.23(INH) RPU5.1 ; port LD_Inhibit
MicroSD CD: Logic_Shifter.4(A3) MicroSD.2(CD/DAT3) ; port MicroSD CD
MicroSD CLK: Logic_Shifter.2(A1) MicroSD.5(CLK) ; port MicroSD CLK
MicroSD CMD: Logic_Shifter.3(A2) MicroSD.3(CMD) ; port MicroSD CMD
MicroSD DAT0: Logic_Shifter.10(B4) MicroSD.7(DAT0) ; port MicroSD DAT0
MicroSD_CS: ARDUINO_NANO.13(D10) Logic_Shifter.11(B3Y) ; port MicroSD CS  [also labelled MicroSD_CS 5V]
MOS_G: OA1.1(OUT1) R13.2
MOSFET_Temp: ARDUINO_NANO.26(A7) C25.2 NTC.1 R1.1 ; port V_NTC  [also labelled NTC]
MUX_ADR0: ARDUINO_NANO.5(D2) MUX.10(S0) ; port MUX_ADR0
MUX_ADR1: ARDUINO_NANO.6(D3) MUX.11(S1) ; port MUX_ADR1
MUX_ADR2: ARDUINO_NANO.7(D4) MUX.14(S2) ; port MUX_ADR2
MUX_ADR3: ARDUINO_NANO.8(D5) MUX.13(S3) ; port MUX_ADR3
MUX_OUT: ARDUINO_NANO.19(A0) OA2.3(VIN-) OA2.4(VOUT) ; port V_CELL_SENSE  [also labelled V_CELL_SENSE]
RD1: LINE_DECODER.11(S0) RELAY_DRIVER_1.1(IN1) ; port RD1
RD2: LINE_DECODER.10(S2) RELAY_DRIVER_1.2(IN2) ; port RD2
RD3: LINE_DECODER.9(S1) RELAY_DRIVER_1.3(IN3) ; port RD3
RD4: LINE_DECODER.8(S3) RELAY_DRIVER_1.4(IN4) ; port RD4
RD5: LINE_DECODER.7(S4) RELAY_DRIVER_1.5(IN5) ; port RD5
RD6: LINE_DECODER.4(S7) RELAY_DRIVER_2.1(IN1) ; port RD6
RD7: LINE_DECODER.5(S6) RELAY_DRIVER_2.2(IN2) ; port RD7
RD8: LINE_DECODER.6(S5) RELAY_DRIVER_2.3(IN3) ; port RD8
RD9: LINE_DECODER.18(S8) RELAY_DRIVER_2.4(IN4) ; port RD9
RD10: LINE_DECODER.17(S9) RELAY_DRIVER_2.5(IN5) ; port RD10
SPI_CS: ARDUINO_NANO.12(D9) R42.2 ; port SPI CS
SPI_MISO 5V: ARDUINO_NANO.15(D12/MISO) Logic_Shifter.5(A4Y) SPI.5 ; port SPI BUS MISO
SPI_MOSI 5V: ARDUINO_NANO.14(D11/MOSI) Logic_Shifter.12(B2Y) SPI.4 ; port SPI BUS MOSI
SPI_SCK 5V: ARDUINO_NANO.16(D13/SCK) Logic_Shifter.13(B1Y) SPI.3 ; port SPI BUS SCK
START_SW: I2C_EXPANDER.9(P05) RPU6.1 START_SW.1 ; port START_SW
STOP_SW: I2C_EXPANDER.10(P06) RPU7.1 STOP_SW.1 ; port STOP_SW
UART_RX: ARDUINO_NANO.2(D0/RX) UART.3
UART_TX: ARDUINO_NANO.1(D1/TX) UART.2
V_Cell: MOSFET_CC.2(D) RELAY1.3 RELAY2.3 RELAY3.3 RELAY4.3 RELAY5.3 RELAY6.3 RELAY7.3 RELAY8.3 RELAY9.3 RELAY10.3 ; port V_Cell
V_CELL1_SIG: CELL1.2(A) R36.1 RPR1.5(D2_1) RPR1.6(D2_2) ; port V_CELL1_SIG
V_CELL2_SIG: CELL2.2(A) R35.1 RPR1.7(D1_1) RPR1.8(D1_2) ; port V_CELL2_SIG
V_CELL3_SIG: CELL3.2(A) R34.1 RPR2.5(D2_1) RPR2.6(D2_2) ; port V_CELL3_SIG
V_CELL4_SIG: CELL4.2(A) R33.1 RPR2.7(D1_1) RPR2.8(D1_2) ; port V_CELL4_SIG
V_CELL5_SIG: CELL5.2(A) R32.1 RPR3.7(D1_1) RPR3.8(D1_2) ; port V_CELL5_SIG
V_CELL6_SIG: CELL6.2(A) R41.1 RPR3.5(D2_1) RPR3.6(D2_2) ; port V_CELL6_SIG
V_CELL7_SIG: CELL7.2(A) R40.1 RPR4.7(D1_1) RPR4.8(D1_2) ; port V_CELL7_SIG
V_CELL8_SIG: CELL8.2(A) R39.1 RPR4.5(D2_1) RPR4.6(D2_2) ; port V_CELL8_SIG
V_CELL9_SIG: CELL9.2(A) R38.1 RPR5.7(D1_1) RPR5.8(D1_2) ; port V_CELL9_SIG
V_CELL10_SIG: CELL10.2(A) R37.1 RPR5.5(D2_1) RPR5.6(D2_2) ; port V_CELL10_SIG
V_IN: BUCK_IC.2(VIN) BUCK_IC.3(EN) C10.1 C11.1 DC_JACK_IN.1 XT60.P(POS)
NetBUCK_IC_1: BUCK_IC.1(BST) C3.2
NetBUCK_IC_4: BUCK_IC.4(RT/CLK) R20.2
NetBUCK_IC_5: BUCK_IC.5(FB) R6.1 R9.2
NetBUCK_IC_6: BUCK_IC.6(SS) C5.1
NetBUCK_IC_8: BUCK_IC.8(SW) C3.1 L1.1
NetC1_2: C1.2 FB1.2 USB_C_IN.A9(VBUS) USB_C_IN.B9(VBUS)
NetC4_1: C4.1 OA2.1(VIN+) R10.1 R11.2
NetC13_1: C13.1 MOSFET_CC.1(G) R13.1
NetC17_1: C17.1 OA1.5(IN2+) R14.1 R17.2
NetD1_1: D1.1(A) RELAY1.2 RELAY_DRIVER_1.16(OUT1)
NetD2_1: D2.1(A) RELAY2.2 RELAY_DRIVER_1.15(OUT2)
NetD3_1: D3.1(A) RELAY3.2 RELAY_DRIVER_1.14(OUT3)
NetD4_1: D4.1(A) RELAY4.2 RELAY_DRIVER_1.13(OUT4)
NetD5_1: D5.1(A) RELAY5.2 RELAY_DRIVER_1.12(OUT5)
NetD6_1: D6.1(A) RELAY6.2 RELAY_DRIVER_2.16(OUT1)
NetD7_1: D7.1(A) RELAY7.2 RELAY_DRIVER_2.15(OUT2)
NetD8_1: D8.1(A) RELAY8.2 RELAY_DRIVER_2.14(OUT3)
NetD9_1: D9.1(A) RELAY9.2 RELAY_DRIVER_2.13(OUT4)
NetD10_1: D10.1(A) RELAY10.2 RELAY_DRIVER_2.12(OUT5)
NetD11_1: D11.1(A) MicroSD.10(A)
NetD11_2: D11.2(K) R19.1
NetDAC_2: DAC.2(VOUT) R14.2
NetDAC_5: DAC.5(SPI2C) R12.2
NetLCD_3: LCD.3(VO) R2.2
NetLCD_15: LCD.15(A) R7.2
NetLINE_DECODER_1: LINE_DECODER.1(STROBE) RPU8.2
NetLogic_Shifter_8: Logic_Shifter.8(OE) R21.1
NetMUX_1: MUX.1(COMMON_INPUT/OUTPUT) R10.2
NetMUX_2: MUX.2(I7) R39.2
NetMUX_3: MUX.3(I6) R38.2
NetMUX_4: MUX.4(I5) R37.2
NetMUX_5: MUX.5(I4) R36.2
NetMUX_6: MUX.6(I3) R35.2
NetMUX_7: MUX.7(I2) R34.2
NetMUX_8: MUX.8(I1) R33.2
NetMUX_9: MUX.9(I0) R32.2
NetMUX_22: MUX.22(I9) R41.2
NetMUX_23: MUX.23(I8) R40.2
NetOA_I_SENSE_3: OA_I_SENSE.3(VIN-) R16.2 R18.1
NetR3_2: R3.2 USB_C_IN.A5(CC1)
NetR4_2: R4.2 USB_C_IN.B5(CC2)
NetR22_1: R22.1 RPR5.4(G2)
NetR23_1: R23.1 RPR3.4(G2)
NetR24_1: R24.1 RPR4.4(G2)
NetR25_1: R25.1 RPR2.4(G2)
NetR26_1: R26.1 RPR1.4(G2)
NetR27_1: R27.1 RPR5.2(G1)
NetR28_1: R28.1 RPR3.2(G1)
NetR29_1: R29.1 RPR2.2(G1)
NetR30_1: R30.1 RPR4.2(G1)
NetR31_1: R31.1 RPR1.2(G1)
NetR42_1: R42.1 R43.2 SPI.6

Not connected (* = marked no-connect by the designer): 3.3V_LDO 4(NC)*; ARDUINO_NANO 3(~{RESET})* 17(+3V3)* 28(~{RESET})* 30(VIN)*; DAC 3(NC)* 9(NC)*; I2C_EXPANDER 1(~{INT})* 11(P07)* 13(P10)* 14(P11)* 15(P12)* 16(P13)* 17(P14)* 18(P15)* 19(P16)* 20(P17)*; LCD 7(DB0)* 8(DB1)* 9(DB2)* 10(DB3)*; LINE_DECODER 13(S13) 14(S12) 15(S15) 16(S14) 19(S11) 20(S10); Logic_Shifter 6(NC) 9(NC); MicroSD 1(DAT2)* 8(DAT1)*; RELAY_DRIVER_1 6(IN6)* 7(IN7)* 10(OUT7)* 11(OUT6)*; RELAY_DRIVER_2 6(IN6)* 7(IN7)* 10(OUT7)* 11(OUT6)*; START_SW 2 4; STOP_SW 2 4; UART 4*

## Notes on the sheet
- 5V Buck / 3.3V LDO
- MCU (Nano / Nucleo)
- Temp Sensor
- LCD MODULE
- CELL MONITORING
- CONSTANT CURRENT SINK
- SEQUANTIAL CELL SWITCHING
- SD CARD and SPI
- CELL HOLDERS
- DWG NO:
- REV:
- THIS DOCUMENT AND THE DATA DISCLOSED HEREIN OR
- HEREWITH IS THE PROPERTY OF ALTIUM LIMITED AND MAY
- BE FREELY DISTRIBUTED IN WHOLE. NO RIGHTS ARE
- RESERVED OR EXPRESS OR IMPLIED WARANTEE GIVEN.
- REVISION
- DESCRIPTION
- DATE
- APPROVED
- ENG:
- APPROVALS
- PROJECT
- DSN:
- CHK:
- REFERENCE DOCUMENTS
- PROJECT REVISION:
- TITLE
- DOCUMENT REVISION:
- DESIGN ITEM:
- BOM:
- FAB DWG:
- PCB DWG:
- ASSY DWG:
- SCALE:
- A2
- SIZE
- CAGE CODE
- FILE NAME
- DWG NO.
- SHEET
- OF
- REV
- (in symbol CMP-008-000000-1) 16x2 LCD
- (in symbol CMP-19636-000019-1) +; -

## Library data of the parts
3.3V_LDO = CMP-2000-07604-2: IC REG LINEAR 3.3V 300MA SOT23-5; Quiescent Current: 38uA; Operating Supply Current: 42uA; Max Input Voltage: 5.5V; Min Input Voltage: 2.5V; Output Type: Fixed; Power Supply Rejection Ratio (PSRR): 60dB; Dropout Voltage: 380mV; Accuracy: 3%; Number of Outputs: 1; Nominal Output Voltage: 3.3V; Max Output Current: 300mA; Length: 2.9mm; Mount: Surface Mount; Width: 1.6mm; Packaging: Tape and Reel; Output Current: 300mA; Min Operating Temperature: -40°C; Max Operating Temperature: 125°C; Height: 1.1mm; Case/Package: SOT-23-5; REACH SVHC: No SVHC; Number of Pins: 5; Output Voltage: 3.3V
ARDUINO_NANO = CMP-189986-000002-1: ARDUINO NANO ATMEGA328 EVAL BRD; Number of Bits: 8; Evaluation Kit: Yes; Operating Supply Voltage: 12V; Interface: I2C; Data Bus Width: 8b; Core Architecture: AVR; Packaging: Bulk; Length: 7inch; Package Quantity: 50; Width: 5inch; REACH SVHC: No SVHC; Weight: 0.358383oz; Series: AVR® ATmega; Height: 0.25inch
BUCK_IC = AP64502QSP-13: Description; Manufacturer_Name: Diodes Inc; Copyright: Copyright (C) 2025 Ultra Librarian. All rights reserved.; Manufacturer_Part_Number: AP64502QSP-13; RefDes: RefDes; Type: Type; Supplier 1: Avnet; Supplier Part Number 1: AP64502QSP-13
C1-C4 C12 C14-C20 C23-C25 = CMP-001-00018-6: Capacitor 100 nF +/-10% 50 V 0805; Voltage Rating: 50V; Tolerance: 10%; Capacitor Type: Ceramic; Value: 100nF; Pins: 2; Max Operating Temperature: 125°C; Min Operating Temperature: -55°C; Mounting Technology: SM; Case/Package: 0805; RoHS Compliant: True
C5-C9 = CMP-2000-05255-3: Chip Multilayer Ceramic Capacitors for General Purpose, 1206, 47uF, X5R, 15%, 20%, 10V; Case/Package: 1206; Radiation Hardening: No; Case Code (Metric): 3216; Max Operating Temperature: 85°C; Capacitance: 47uF; Tolerance: 20%; REACH SVHC: No SVHC; Depth: 1.6mm; Case Code (Imperial): 1206; Termination: SMD/SMT; Voltage Rating (DC): 10V; Package Quantity: 2000; Voltage Rating: 10V; Width: 1.6mm; Lead Free: Lead Free; Voltage: 10V; Packaging: Tape and Reel; Length: 3.2mm; Height: 1.6mm; Number of Pins: 2; Thickness: 0.071inch; Min Operating Temperature: -55°C; Dielectric: X5R; Mount: Surface Mount
C10 C11 = CMP-13271-000016-1: CAP CER 10UF 50V X5R 1206; Manufacturer: Samsung; Manufacturer Part Number: CL31A106KBHNNNE; Tolerance: 10%; Material: Ceramic; Temperature Coefficient: 15%; RoHS: TRUE; Ipc Land Pattern Name: CAPC320160X160; Temperature Range Low: -55°C; Value: 10uF; Device Class L3: Ceramic Capacitors; Category: Cap; Temperature Characteristic: X5R; Lead Free: Yes; Device Class L2: Capacitors; Octopart: https://octopart.com/cl31a106kbhnnne-samsung-19832778; ComponentLink2Description: Datasheet; Digikey Description: CAP CER 10UF 50V X5R 1206; Voltage: 50V; ComponentLink2URL: http://www.samsungsem.com/kr/support/product-search/mlcc/__icsFiles/afieldfile/2018/06/21/CL31A106KBHNNNE.pdf; Capacitance: 10uF; Temperature Range High: +85°C; Device Class L1: Passive Components; Height: 1.8mm; Automotive: No; Voltage Rating: 50V; Package: CL31; Temperature: -55°C to +85°C
C13 = CMP-06035-023057-1: Ceramic Capacitor for Automotive 10nF  ±10% 100VDC X8R 0805 Paper T/R
C21 C22 = CMP-2000-04991-1: Chip Capacitor, 1 uF, +/- 10%, 25 V, -55 to 125 degC, 1206 (3216 Metric), RoHS, Tape and Reel; Manufacturer: Kemet; Temperature Coefficient / Code: +/-15%; Dielectric: X7R; Voltage Rating DC: 25V; Capacitance - nF: 1000nF; Class: Class1; Case Length: 3.2mm; Type: SMDMLCCX7R6.3-250VDCCommericalGrade; Case Width: 1.6mm; Product: GeneralTypeMLCCs; Capacitance: 1uF; Datasheet URL: https://ciiva.com/datasheet-click-18194173?src=ciiva&sig=6daff8c4; Operating Temperature Range: -55Cto+125C; Series: C1206C; RoHS: Details; Product Category: MultilayerCeramicCapacitorsMLCC-SMD/SMT; Manufacturer URL: http://www.kemet.com/; Minimum Operating Temperature: -55C; Dimensions: 1.6mmWx3.2mmLx1.6mmH; Termination Style: SMD/SMT; Brand: Kemet; Packaging: Reel; Package / Case: 1206(3216metric); Case Code - mm: 3216; Datasheet Version: Jul-14; Factory Pack Quantity: 2000; Package Description: 2-Pin Surface Mount Device, Body 3.2 x 1.6 mm; Tolerance: 10%; Package Reference: 1206; Case Height: 1.6mm; Case Code - in: 1206; Maximum Operating Temperature: +125C; Voltage Rating: 25V
CELL1-CELL10 = CMP-19636-000019-1: BATTERY HOLDER 18650 SMD TAB; Number of Cells: 1; Max Operating Temperature: 145°C; Termination: SMD/SMT; Mount: Surface Mount; Min Operating Temperature: -50°C; Package Quantity: 200; Packaging: Tray; Lead Free: Lead Free
D1-D10 = CMP-0639-00001-1: Surface Mount Glass Passivated Rectifier, 1000V, 1 A, -65 to 125 degC, 2-Pin SMA Package, RoHS, Tape and Reel; Manufacturer: Diodes Inc; Maximum Reverse Current IR (uA): 5; Maximum Peak Forward Surge Current IFSM (A): 30; Maximum Average Rectified Current IO (A): 1; Peak Repetitive Reverse Voltage VRRM (V): 1000; Total Capacitance CT (pF): 10; Forward Voltage Drop VF (V): 1.1; ComponentLink1URL: http://www.diodes.com/; Operating Temperature Range: -65 to 150 degC; ComponentLink3URL: http://diodes.com/datasheets/ds16003.pdf; ComponentLink3Description: Package Specification; PackageDescription: 2-Pin SMD, Body 4.3 x 2.605 mm, Height 2.3 mm; Mounting Technology: Surface Mount; ComponentLink1Description: Manufacturer URL; PackageReference: S1M-13-F-SMA-2; ComponentLink2URL: http://diodes.com/datasheets/ds16003.pdf; ComponentLink2Description: Datasheet; RoHS: TRUE; DatasheetVersion: Rev. 22 - 2; Packing: Tape and Reel; PackageVersion: Rev. 22 - 2; PartNumber: S1M-13-F
D11 = CMP-2000-06621-1: LTST-C170KSKT LED Yellow, 75 mW, 80 mA, -55 to 85 degC, 2-Pin SMD, RoHS, Tape and Reel; Manufacturer: Lite-On; Main Category: ChipLED; Product Depth (mm): 1.25mm; Dominant Wave Length: 587nm; Viewing Angle: 130deg; Luminous Intensity: 112mcd; Test Current (It): 20mA; Emitting Color: Amber; Chip Material: AlGaInP; Product Height (mm): 1.1mm; Forward Voltage: 2.4V; High Brightness: Yes; Forward Current: 30mA; Number of  Elements: 1; Power Dissipation: 75W; Type: Uni-Color; Shape Type: Rectangular; Peak Wavelength: 588nm; Reverse Voltage: 5V; Rad Hardened: No; Product Length (mm): 2mm; DELETED: Compliant; Package Description: 2-Pin Surface Mount Device, Body 2 x 1.25 mm; Mounting: SurfaceMount; Lum Intensity: 112mcd; Pin Count: 2; Mounting Technology: SurfaceMount; Package Reference: C170KSKT; Datasheet Version: Rev. H, 04/2014; Package Type: ChipLed; Packaging: TapeandReel; Manufacturer URL: http://www.us.liteon.com/; Datasheet URL: http://optoelectronics.liteon.com/upload/download/DS-22-99-0188/S_110_LTST-C170KSKT.pdf; Operating Temp Range: -55Cto85C; Lens Dimensions: 1.4x1.25x0.6mm; Operating Temperature Classification: Industrial
DAC = DAC60501ZDGSR: True 12-bit, 1-ch, SPI/I2C, voltage-output DAC in WSON package with precision internal reference 10-VSSOP -40 to 125; Manufacturer_Name: Texas Instruments; Copyright: Copyright (C) 2025 Ultra Librarian. All rights reserved.; Manufacturer_Part_Number: DAC60501ZDGSR; RefDes: RefDes; Type: Type
DC_JACK_IN = CMP-2000-06901-1: Through Hole Right Angle DC Power Jack, 5 A, 2.5 mm Center Pin, 3 Position, -25 to 85 degC, RoHS, Bulk; Manufacturer: CUIInc.; Outside Contact Diameter: 6.5mm; Current Rating: 5A; Brand: CUI; Insulation Resistance: 100MOhms; Inside Contact Diameter: 2.5mm; Voltage Rating: 24V; Operating Temperature Range: -25Cto+85C; Mounting Angle: Right; Mounting Technology: ThroughHole; Product Category: DCPowerConnectors; Datasheet Version: Rev. 1.02, 05/2016; Connector Type: DCPowerJack; Contact Material: Copper; Housing Material: PolybutyleneTerephthalate(PBT); Mounting Style: ThroughHole; Product: Jacks; Package Reference: PJ-102BH; Manufacturer URL: http://www.cui.com/; RoHS: True; Contact Gender: Male; Contact Plating: Nickel; Flammability Rating: UL94V-0; Factory Pack Quantity: 280; Datasheet URL: http://www.cui.com/product/resource/pj-102bh.pdf; Package Description: 3-Pin Through Hole Device, Body 14.4 x 9 mm, Height 11 mm; Termination Style: ThroughHole
FB1 = CMP-0686-00732-3: BLM31PG121SN1L Chip Ferrite Bead Array, 1206, 120Ω @ 100MHz, 0.02Ω, 25%, 3.5A; Number of Lines: 1; DC Current: 3A; Impedance: 120R; Material: Steel; DC Resistance (DCR): 20mR; Shielding: Unshielded; Number of Pins: 2; Case Code (Metric): 3216; Contact Plating: Tin; Radiation Hardening: No; Termination: SMD/SMT; Lead Free: Lead Free; Core Material: Ferrite; Case Code (Imperial): 1206; Test Frequency: 100MHz; Depth: 1.6mm; Max Operating Temperature: 125°C; Package Quantity: 3000; Packaging: Tape and Reel; Min Operating Temperature: -55°C; Length: 3.2mm; Current Rating: 3.5A; RoHS Compliant: Yes; Tolerance: 25%; Width: 1.6mm; Max Current Rating: 3.5A; Frequency: 100MHz; Military Standard: Not; Case/Package: 1206; Max DC Current: 3A; Height: 1.1mm
I2C UART = CMP-02766-001388-1: CONN HEADER VERT 4POS 2.54MM; Number of Contacts: 4; Gender: Male; Connector Type: Male Pin; Max Voltage Rating (AC): 550V; Max Current Rating: 7.6A; Radiation Hardening: No; Lead Free: Lead Free; RoHS Compliant: Yes; Contact Material: Bronze; Number of Positions: 4; Housing Color: Black; Min Operating Temperature: -55°C; Mount: Through Hole; Number of Rows: 1; Orientation: Straight; Contact Mating Length: 0.23inch; Contact Type: Male Pin; REACH SVHC: No SVHC; Max Operating Temperature: 105°C; Color: Black; Pitch: 2.54mm; Length: 10.16mm; Series: TSW; Packaging: Bulk; Contact Plating: Tin; Package Quantity: 1; Termination: Solder; Housing Material: Polyester; Width: 2.54mm; Depth: 2.54mm
I2C_EXPANDER = CMP-0314-00318-2: Remote 16-Bit I2C and SMBus I/O Expander with Interrupt Output, 2.5 to 5.5 V, -40 to 85 degC, 24-pin TSSOP (PW), Green (RoHS & no Sb/Br); Manufacturer: Texas Instruments; SubFamily: I2C IO Expander; VCC(Min)(V): 2.5; I2C Address: 0100 xxx; # of I/Os: 16; Interrupt Output: Yes; Max Frequency(kHz): 400; fSCLK(Max)(MHz): 0.4; Voltage Nodes(V): 5.5, 3.6, 2.7, 2.5; VCC(Max)(V): 5.5; Code_JEDEC: MO-153; ComponentLink2URL: http://www.ti.com/litv/pdf/mpds177g; PackageVersion: revG, Feb-2011; Vcc range(V): 2.5 to 5.5; Mounting Technology: Surface Mount; ComponentLink2Description: Package Specification; ComponentLink1Description: Datasheet; Reset Input: No; DatasheetVersion: SCPS121D; ComponentLink1URL: http://www.ti.com/general/docs/lit/getliterature.tsp?genericPartNumber=PCF8575&fileType=pdf; Eco-Plan: Green (RoHS & no Sb/Br); PackageDescription: 24-Pin Thin Small Outline Package 0.65 mm Pitch; Push-Pull I/O Type: Yes; PartNumber: PCF8575PWR; PackageReference: PW0024A
L1 = CMP-006-00023-1: 6.8 ÂµH Shielded Molded Inductor 5 A 50mOhm Max Nonstandard; MF: Laird-Signal Integrity Products; SnapEDA_Link: https://www.snapeda.com/parts/MGAH06036R8M-10/Laird/view-part/?ref=snap; Price: None; Availability: In Stock; Pins: 2; Design Item ID: MGAH06036R8M-10; Check_prices: https://www.snapeda.com/parts/MGAH06036R8M-10/Laird/view-part/?ref=eda; Component Type: Standard; Case/Package: None; Purchase-URL: https://pricing.snapeda.com/search/part/MGAH06036R8M-10/?ref=eda; MP: MGAH06036R8M-10; Source: MGAH06036R8M-10.SchLib
LCD = CMP-008-000000-1: Display Development Tools 16x2 Black on Green Char LCD w Backlight; MF: Gravitech; MP: LCD-16X2; Pin Count: 16; Package: None; SnapEDA_Link: https://www.snapeda.com/parts/LCD-16X2/Gravitech/view-part/?ref=snap; Design Item ID: LCD-16X2; Source: LCD-16X2.SchLib; Check_prices: https://www.snapeda.com/parts/LCD-16X2/Gravitech/view-part/?ref=eda; Component Type: Standard; Value: *
LINE_DECODER = CMP-1633-00346-2: CMOS 4-Bit Latch/4-to-16 Line Decoder with Output 'High' on Select, DW0024A, LARGE T&R; Manufacturer: Texas Instruments; F @ Nom Voltage(Max)(Mhz): 8; Output Drive (IOL/IOH)(Max)(mA): 1.5/-1.5; Function: Decoder/Demultiplexer; ICC @ Nom Voltage(Max)(mA): 0.3; Channels(#): 4; Rating: Catalog; VCC(Max)(V): 18; Bits(#): 16; VCC(Min)(V): 3; Technology Family: CD4000; Schmitt Trigger: No; Voltage(Nom)(V): 5,10,15; tpd @ Nom Voltage(Max)(ns): 370; Configuration: 4：16; Type: Standard; Generic Part Number: CD4514B; DatasheetVersion: SCHS074A; Operating Temperature Range(C): -55 to 125; Code_JEDEC: MS-013; Output Type: CMOS; PackageReference: DW0024A; Input Type: CMOS
Logic_Shifter = TXU0304PWR: Four-channel fixed multidirectional level shifter 14-TSSOP -40 to 125; Manufacturer_Name: Texas Instruments; Copyright: Copyright (C) 2025 Ultra Librarian. All rights reserved.; Manufacturer_Part_Number: TXU0304PWR; RefDes: RefDes; Type: Type
MicroSD = CMP-11597-000006-1: CONN MICRO SD R/A PUSH-PUSH SMD; Contact Resistance: 100mR; Insulation Resistance: 1GR; Gender: Receptacle; Max Voltage Rating (AC): 125V; Pitch: 1.1mm; Mating Cycles: 10000; Max Current Rating: 500mA; Connector Type: Connector; Number of Contacts: 8; Housing Material: Polymer; Flammability Rating: UL94 V-0; REACH SVHC: No SVHC; Lead Free: Lead Free; Package Quantity: 400; Length: 13.85mm; Number of Rows: 2; Series: DM3; Min Operating Temperature: -25°C; Voltage Rating (AC): 125V; Contact Material: Copper Alloy; Depth: 15.95mm; Contact Plating: Gold; Packaging: Tape and Reel; Width: 13.85mm; Orientation: Right Angle; Color: Black; Voltage Rating: 125V; Radiation Hardening: No; Termination: Solder; Current Rating: 500mA; Mount: Surface Mount; Max Operating Temperature: 85°C
MOSFET_CC = CMP-32901-000488-1: MOSFET N-CH 55V 47A TO220AB; Turn-On Delay Time: 11ns; Gate to Source Voltage (Vgs): 16V; Element Configuration: Single; Rds On Max: 22mR; Turn-Off Delay Time: 26ns; Max Power Dissipation: 110W; Threshold Voltage: 2V; Drain to Source Resistance: 35mR; Input Capacitance: 1.7nF; Continuous Drain Current (ID): 47A; Case/Package: TO-220; Lead Free: Lead Free; Halogen Free: Halogen Free; Packaging: Rail/Tube; Length: 0.414inch; Min Operating Temperature: -55°C; REACH SVHC: No SVHC; Number of Pins: 3; Width: 0.185inch; Drain to Source Voltage (Vdss): 55V; Power Dissipation: 110W; RoHS Compliant: Yes; Max Operating Temperature: 175°C; Height: 0.6inch; Max Dual Supply Voltage: 55V; Drain to Source Breakdown Voltage: 55V; Mount: Through Hole
MUX = CMP-04892-000038-1: IC MUX/DEMUX 1X16 24SSOP; Supply Type: Single; High Level Output Current: 25mA; Min Supply Voltage: 2V; Number of Circuits: 16; Max Supply Voltage: 6V; Number of Channels: 1; Turn-On Delay Time: 300ns; Max Supply Current: 8uA; Bandwidth: 89MHz; Turn-Off Delay Time: 290ns; Propagation Delay: 75ns; Logic Function: Multiplexer; On-State Resistance: 160R; Polarity: Non-Inverting; Width: 5.3mm; Case/Package: SSOP; Max Operating Temperature: 125°C; Mount: Surface Mount; Min Operating Temperature: -55°C; REACH SVHC: No SVHC; Contact Plating: Gold; Max Output Current: 25mA; Weight: 0.006081oz; Height: 1.95mm; Package Quantity: 2000; Length: 8.2mm; Lead Free: Lead Free; Operating Supply Current: 8uA; Packaging: Tape and Reel; Series: 74HC; Low Level Output Current: 25mA; Number of Outputs: 1; Termination: SMD/SMT; Number of Inputs: 16; Number of Bits: 16; Radiation Hardening: No; Number of Pins: 24
NTC = CMP-06022-001050-1: Thermistor NTC 10kΩ ±1% 2-Pin Radial Bulk; Resistance: 10kR; Max Power Dissipation: 7.5mW; Lead Diameter: 0.4mm; RoHS Compliant: Yes; Number of Pins: 2; Lead Free: Lead Free; Height: 2mm; Lead Pitch: 2.5mm; Power Rating: 7.5mW; Series: NXR; Packaging: Bulk; Package Quantity: 500; Width: 4mm; Max Operating Temperature: 125°C; Termination: Radial; Min Operating Temperature: -40°C; Tolerance: 1%; Resistance Tolerance: 1%; Length: 5mm; Mount: Through Hole
OA1 = CMP-014-00004-1: Dual, 16V, 11MHz, rail-to-rail input and output low-offset-voltage low-noise operational amplifier; MF: Texas Instruments; SnapEDA_Link: https://www.snapeda.com/parts/TLV9162IDDFR/Texas+Instruments/view-part/?ref=snap; Case/Package: SOT-23-THN-8 Texas Instruments; Component Type: Standard; Design Item ID: TLV9162IDDFR; MP: TLV9162IDDFR; Pins: 8; Source: TLV9162IDDFR.SchLib; Check_prices: https://www.snapeda.com/parts/TLV9162IDDFR/Texas+Instruments/view-part/?ref=eda; Value: *
OA2 OA_I_SENSE = CMP-0187-00480-3: None; Number of Channels: 1; Max Supply Voltage: 6V; Slew Rate: 0.6V/µs; Common Mode Rejection Ratio: 60dB; Gain Bandwidth Product: 1MHz; Amplifier Type: GENERAL PURPOSE; Power Supply Rejection Ratio (PSRR): 86dB; Supply Current: 100uA; Voltage Gain: 112dB; Input Bias Current: 1pA; Output Current: 23mA; Min Supply Voltage: 1.8V; Operating Supply Voltage: 5.5V; Input Offset Voltage-Max: 4.5mV; REACH SVHC: No SVHC; Number of Amplifiers: 1; Max Operating Temperature: 125°C; RoHS Compliant: Yes; Min Operating Temperature: -40°C; Number of Elements: 1; Slew Rate-Nom: 0.6V/µs; Mount: Surface Mount; Package Quantity: 3000; Number of Circuits: 1; Lead Free: Lead Free; Height: 1.3mm; Number of Pins: 5; Nominal Supply Current: 100uA; Radiation Hardening: No; Length: 3.1mm; Width: 1.8mm; Packaging: Tape and Reel; Unity Gain Bandwidth Product: 1MHz; Case/Package: SOT-23; Bandwidth: 1MHz; Input Offset Voltage (Vos): 4.5mV; Technology: CMOS
R1 R11 = CMP-009-00018-5: Chip Resistor, 10 KOhm, +/- 1%, 125 mW, -55 to 155 degC, 0805 (2012 Metric); Power: 125mW; Voltage Rating: 150V; Tolerance: 1%; Pins: 2; Min Operating Temperature: -55°C; Case/Package: 0805; Max Operating Temperature: 155°C; RoHS Compliant: True; Mounting Technology: SM
R2 = CMP-26527-005916-1: 1.3kΩ ±5% 0.125W 0805 Thick Film Chip Resistor AEC-Q200 compliant; Max Power Dissipation: 125mW; Temperature Coefficient: 200ppm/°C; Resistance: 1.3kR; Mount: Surface Mount; Width: 0.049inch; Case/Package: 0805; Depth: 1.25mm; Case Code (Metric): 2012; Length: 0.079inch; Min Operating Temperature: -55°C; RoHS Compliant: Yes; Features: Automotive AEC-Q200; Number of Terminations: 2; Resistor Type: Thick Film; Packaging: Tape and Reel; Height: 0.026inch; Series: RMCF; Construction: Rectangular; Case Code (Imperial): 0805; Military Standard: Not; Tolerance: 5%; Max Operating Temperature: 155°C; Radiation Hardening: No; Package Quantity: 5000; Contact Plating: Tin
R3 R4 = CMP-02407-010205-1: MCT06030D5101BP500 RES SMD 5100 OHM 1% 1/8W 0603; Resistance: 5.1kR; Tolerance: 0.1%; Temperature Coefficient: 25ppm/°C; Max Operating Temperature: 125°C; Radiation Hardening: No; Composition: Thin Film; Height: 450um; Lead Free: Lead Free; Contact Plating: Tin; Length: 1.55mm; Width: 850um; Case/Package: 0603; Min Operating Temperature: -55°C
R5 R8 = CMP-009-00032-5: Chip Resistor, 4.7 KOhm, +/- 1%, 0.125 W, -55 to 155 degC, 0805 (2012 Metric); Power: 125mW; Voltage Rating: 150V; Mounting Technology: SM; RoHS Compliant: True; Tolerance: 1%; Min Operating Temperature: -55°C; Max Operating Temperature: 155°C; Case/Package: 0805; Pins: 2
R6 = CMP-02407-010835-1: MCU08050C4302FP500 RES 1.05K OHM 0.5% 1/5W 0805; Tolerance: 1%; Resistance: 43000R; Height: 450um; Lead Free: Lead Free; Length: 2mm; Case/Package: 0805; Width: 1.25mm
R7 = CMP-26527-006932-1: 220Ω ±5% 0.125W 0805 Thick Film Chip Resistor AEC-Q200 compliant; Resistance: 220R; Max Power Dissipation: 125mW; Temperature Coefficient: 200ppm/°C; Min Operating Temperature: -55°C; Max Operating Temperature: 155°C; Military Standard: Not; Resistor Type: Thick Film; Radiation Hardening: No; Length: 0.079inch; Contact Plating: Tin; Number of Terminations: 2; Depth: 1.25mm; Construction: Rectangular; Width: 0.049inch; Case/Package: 0805; Case Code (Metric): 2012; Tolerance: 5%; Packaging: Tape and Reel; Lead Free: Lead Free; Series: RMCF; RoHS Compliant: Yes; Mount: Surface Mount; Case Code (Imperial): 0805; Features: Automotive AEC-Q200; Height: 0.026inch
R9 = CMP-1013-00613-1: 8K2 0.125W 1% 0805 (2012 Metric)  SMD; Value: 8200.00 Ohm; Case-EIA: 0805; Case-Metric: 2012; Power: 0.125 W; Tolerance: 1 %; Technology: SMT
R10 = CMP-02407-001990-1: CRCW08057K50FKEAHP RES Thick Film, 7.5kΩ, 1%, 0.5W, 100ppm/°C, 0805; Resistance: 7.5kR; Max Power Dissipation: 500mW; Height: 0.024inch; Max Operating Temperature: 155°C; Tolerance: 1%; Case/Package: 0805; Lead Free: Lead Free; Min Operating Temperature: -55°C; Military Standard: Not; Length: 0.079inch; Temperature Coefficient: 100ppm/°C; Package Quantity: 5000; Depth: 1.25mm; Width: 0.049inch; Packaging: Tape and Reel; Composition: Thick Film; Features: Automotive AEC-Q200; Number of Terminations: 2; Contact Plating: Tin
R12 R22-R31 = CMP-03412-040683-1: RES 10kΩ 5.00% 0.2W 0603
R13 R19 = CMP-07231-003646-1: CR0805-FX-3000ELF Thick Film Chip Resistors 0805 300Ω 0.125W 1% 100ppm/°C; Max Power Dissipation: 125mW; Voltage Rating: 150V; Resistance: 300R; Contact Plating: Tin; Number of Terminations: 2; Termination: SMD/SMT; Case Code (Imperial): 0805; Mount: Surface Mount; Length: 2mm; Thickness: 508um; Package Quantity: 1; Case Code (Metric): 2012; Width: 1.25mm; Military Standard: Not; Max Operating Temperature: 155°C; Temperature Coefficient: 100ppm/°C; Min Operating Temperature: -55°C; Features: Moisture Resistant; Radiation Hardening: No; Composition: Thick Film; Height: 0.024inch; Power Rating: 125mW; Depth: 1.25mm; Tolerance: 1%; Packaging: Tape and Reel; Case/Package: 0805
R14 R16 = CMP-03211-002159-1: CRGP0805F18K CRGP0805 18KΩ 0.33W ±100ppm/°C 1% 150V; Manufacturer: TE; Tolerance: 0.01; Device Class L3: Chip SMD Resistors; Value: 18KΩ; ComponentLink2Description: Datasheet; Temperature Range Low: -55°C; Lead Free: Yes; Temperature Coefficient: ±100ppm/°C; Resistance: 18KΩ; Manufacturer Part Number: CRGP0805F18K; Series: CRGP; Temperature: -55°C to +155°C; Ambient Temperature Range High: +70°C; Package: CRGP0805; RoHS: TRUE; Octopart: https://octopart.com/crgp0805f18k-te+connectivity-91018794; Automotive: No; Device Class L2: Resistors; Voltage Rating: 150V; ComponentLink2URL: https://www.mouser.com/datasheet/2/418/NG_DS_9-1773463-9_A-1358566.pdf; Power Rating: 0.33W; Description: CRGP0805 18KΩ 0.33W ±100ppm/°C 1% 150V; Composition: Thick Film; Device Class L1: Passive Components; Category: Res; Ipc Land Pattern Name: RESC200125X55; Height: 0.65mm; Temperature Range High: +155°C
R15 = CMP-04015-026717-1: RN73R2ATTD1001B10 1kΩ ±0.1% 0.125W, 1/8W Chip Resistor 0805 (2012 Metric) Moisture Resistant Thin Film
R17 R18 = CMP-02407-000077-1: MCU08050D2001BP500 RES 1.05K OHM 0.5% 1/5W 0805; Tolerance: 0.1%; Max Power Dissipation: 125mW; Temperature Coefficient: 25ppm/°C; Resistance: 2kR; Package Quantity: 5000; Min Operating Temperature: -55°C; Radiation Hardening: No; Number of Terminations: 2; Width: 0.049inch; Max Operating Temperature: 125°C; Lead Free: Lead Free; Case/Package: 0805; Length: 0.079inch; Composition: Thin Film; Packaging: Tape and Reel; Contact Plating: Tin; Height: 0.022inch; Depth: 1.25mm; Military Standard: Not
R20 = CMP-02407-007717-1: RES Thick Film, 200kΩ, 1%, 0.33W, 100ppm/°C, 0603; Resistance: 200kR; Max Power Dissipation: 250mW; Tolerance: 1%; Composition: Thick Film; Features: Automotive AEC-Q200; Min Operating Temperature: -55°C; Case/Package: 0603; Length: 0.063inch; Max Operating Temperature: 155°C; Number of Terminations: 2; Height: 0.022inch; Military Standard: Not; Package Quantity: 5000; Width: 0.033inch; Temperature Coefficient: 100ppm/°C; Lead Free: Lead Free; Packaging: Tape and Reel; Depth: 0.85mm
R21 RPU1-RPU8 = CMP-009-00032-5: Chip Resistor, 4.7 KOhm, +/- 1%, 0.125 W, -55 to 155 degC, 0805 (2012 Metric); Value: 4.7k; Voltage Rating: 150V; Power: 125mW; Tolerance: 1%; Mounting Technology: SM; RoHS Compliant: True; Min Operating Temperature: -55°C; Max Operating Temperature: 155°C; Case/Package: 0805; Pins: 2
R32-R41 = CMP-250906-173560-1: TFCR0603-10W-E-2001BT
R42 = CMP-03211-000516-1: CRGCQ0603F1K2; Manufacturer: TE Connectivity; Power Rating: 0.1W; Resistance: 1.2KΩ; Value: 1.2KΩ; Voltage Rating: 75V; Temperature Coefficient: ±100ppm/°C; Tolerance: 0.01; Octopart: https://octopart.com/crgcq0603f1k2-te+connectivity-91018051; ComponentLink2Description: Datasheet; ComponentLink2URL: https://www.te.com/commerce/DocumentDelivery/DDEController?Action=showdoc&DocId=Data+Sheet%7F1773204-3%7F1%7Fpdf%7FEnglish%7FENG_DS_1773204-3_1.pdf%7F4-2176339-710; Category: Res; Temperature: -55°C to +155°C; Temperature Range High: +155°C; Ipc Land Pattern Name: RESC16080X45; Device Class L2: Resistors; Height: 0.55mm; Ambient Temperature Range High: +70°C; RoHS: TRUE; Package: CRGCQ0603; Temperature Range Low: -55°C; Digikey Description: CRGCQ 0603 1K2 1%; Series: CRGCQ; Lead Free: Yes; Manufacturer Part Number: CRGCQ0603F1K2; Device Class L1: Passive Components; Composition: Thick Film; Device Class L3: Chip SMD Resistors
R43 = CMP-03211-010325-1: CRGCQ0603F2K2; Manufacturer: TE Connectivity; Power Rating: 0.1W; Value: 2.2KΩ; Tolerance: 0.01; Temperature Coefficient: ±100ppm/°C; Voltage Rating: 75V; Height: 0.55mm; RoHS: TRUE; Digikey Description: CRGCQ 0603 2K2 1%; Composition: Thick Film; Lead Free: Yes; Device Class L2: Resistors; Device Class L3: Chip SMD Resistors; Temperature Range High: +155°C; ComponentLink2URL: https://www.te.com/commerce/DocumentDelivery/DDEController?Action=showdoc&DocId=Data+Sheet%7F1773204-3%7F1%7Fpdf%7FEnglish%7FENG_DS_1773204-3_1.pdf%7F4-2176339-766; Device Class L1: Passive Components; Package: CRGCQ0603; Manufacturer Part Number: CRGCQ0603F2K2; Temperature: -55°C to +155°C; Temperature Range Low: -55°C; ComponentLink2Description: Datasheet; Resistance: 2.2KΩ; Category: Res; Octopart: https://octopart.com/crgcq0603f2k2-te+connectivity-91018063; Ipc Land Pattern Name: RESC16080X45; Ambient Temperature Range High: +70°C; Series: CRGCQ
RELAY1-RELAY10 = CMP-08822-000152-1: RELAY GEN PURPOSE SPST 10A 5V; Coil Resistance: 63R; Power Rating: 400mW; Max Voltage Rating (AC): 250V; Release Time: 5ms; Max Voltage Rating (DC): 125V; Coil Current: 79.4mA; Coil Type: Non-Latching; Operate Time: 10ms; Relay Type: General Purpose; Coil Voltage (DC): 5V; RoHS Compliant: Yes; Power Consumption: 400mW; Package Quantity: 500; Max Operating Temperature: 85°C; Termination: Solder; Length: 22.5mm; Packaging: Tray; Number of Pins: 4; Max Current Rating: 10A; Mount: Through Hole; Height: 19mm; Throw Configuration: SPST; Min Operating Temperature: -40°C; Coil Power: 400mW; Contact Material: Tin; Contact Current Rating: 10A; Weight: 12g; Lead Free: Lead Free; Width: 16.5mm
RELAY_DRIVER_1 RELAY_DRIVER_2 = CMP-04912-000075-1: MOSFET 7CH 16SOIC; Power Dissipation: 860mW; Output Current: 140mA; Collector Emitter Voltage (VCEO): 20V; Collector Emitter Saturation Voltage: 750mV; Output Voltage: 16V; Number of Drivers: 7; Number of Pins: 16; RoHS Compliant: Yes; Height: 1.5mm; Package Quantity: 1; REACH SVHC: No SVHC; Series: -; Min Operating Temperature: -40°C; Max Power Dissipation: 860mW; Max Collector Current: 140mA; Mount: Surface Mount; Packaging: Tape and Reel; Radiation Hardening: No; Case/Package: SOIC; Max Operating Temperature: 85°C; Number of Outputs: 7; Lead Free: Lead Free; Width: 4mm; Weight: 0.004998oz; Length: 10mm
RPR1-RPR5 = MCQ7328-TP: Integrated Circuit; Manufacturer_Name: MCC; Datasheet Link: https://www.mccsemi.com/pdf/Products/MCQ7328(SOP-8).pdf; Height: 1.75mm; Manufacturer_Part_Number: MCQ7328-TP
SHUNT = CMP-07231-007405-1: RES 0.05 OHM 1% 3W 2512
SPI = CMP-1024-00383-1: 0.025" SQ Post Header, Through-hole, Vertical, -55 to 125 degC, 2.54 mm Pitch, 6-Pin, Male, RoHS; Manufacturer: Samtec; Pitch: 2.54 mm; RoHS: True; ComponentLink1Description: Manufacturer URL; DatasheetVersion: F-214; Orientation: Vertical; ComponentLink1URL: http://www.samtec.com; ComponentLink3Description: Package Specification; ComponentLink2Description: Datasheet; PackageVersion: DM, 8/1988; PackageDescription: .025[0.64] SQ. Post Terminal Strip Assembly; PackageReference: TSW-106-07-X-S; Mounting Technology: Through-hole; Temperature Range: -55 to 125 degC; ComponentLink3URL: http://www.samtec.com/documents/webfiles/cpdf/TSW-XXX-XX-XXX-X-XX-XXX-MKT.pdf; ComponentLink2URL: http://www.samtec.com/documents/webfiles/pdf/TSW_TH.PDF; PartNumber: TSW-106-07-G-S
START_SW STOP_SW = CMP-03407-000026-1: SWITCH TACTILE SPST-NO 0.05A 24V; RoHS Compliant: Yes
USB_C_IN = CMP-245163-000004-1: CONN RCPT TYPE C 6P SMD RA
XT60 = CMP-002-00073-1: Plug; DC supply; XT60; male; PIN: 2; for cable; soldered; 30A; 500V; MF: AMASS; Design Item ID: XT60-M; Component Type: Standard; Case/Package: Package; MP: XT60-M; Value: *; Pins: 2; Check_prices: https://www.snapeda.com/parts/XT60-M/AMASS/view-part/?ref=eda; Source: XT60-M.SchLib; SnapEDA_Link: https://www.snapeda.com/parts/XT60-M/AMASS/view-part/?ref=snap